# Altium project TP3_Microcontrolador.PrjPcb (part 1 of 2)
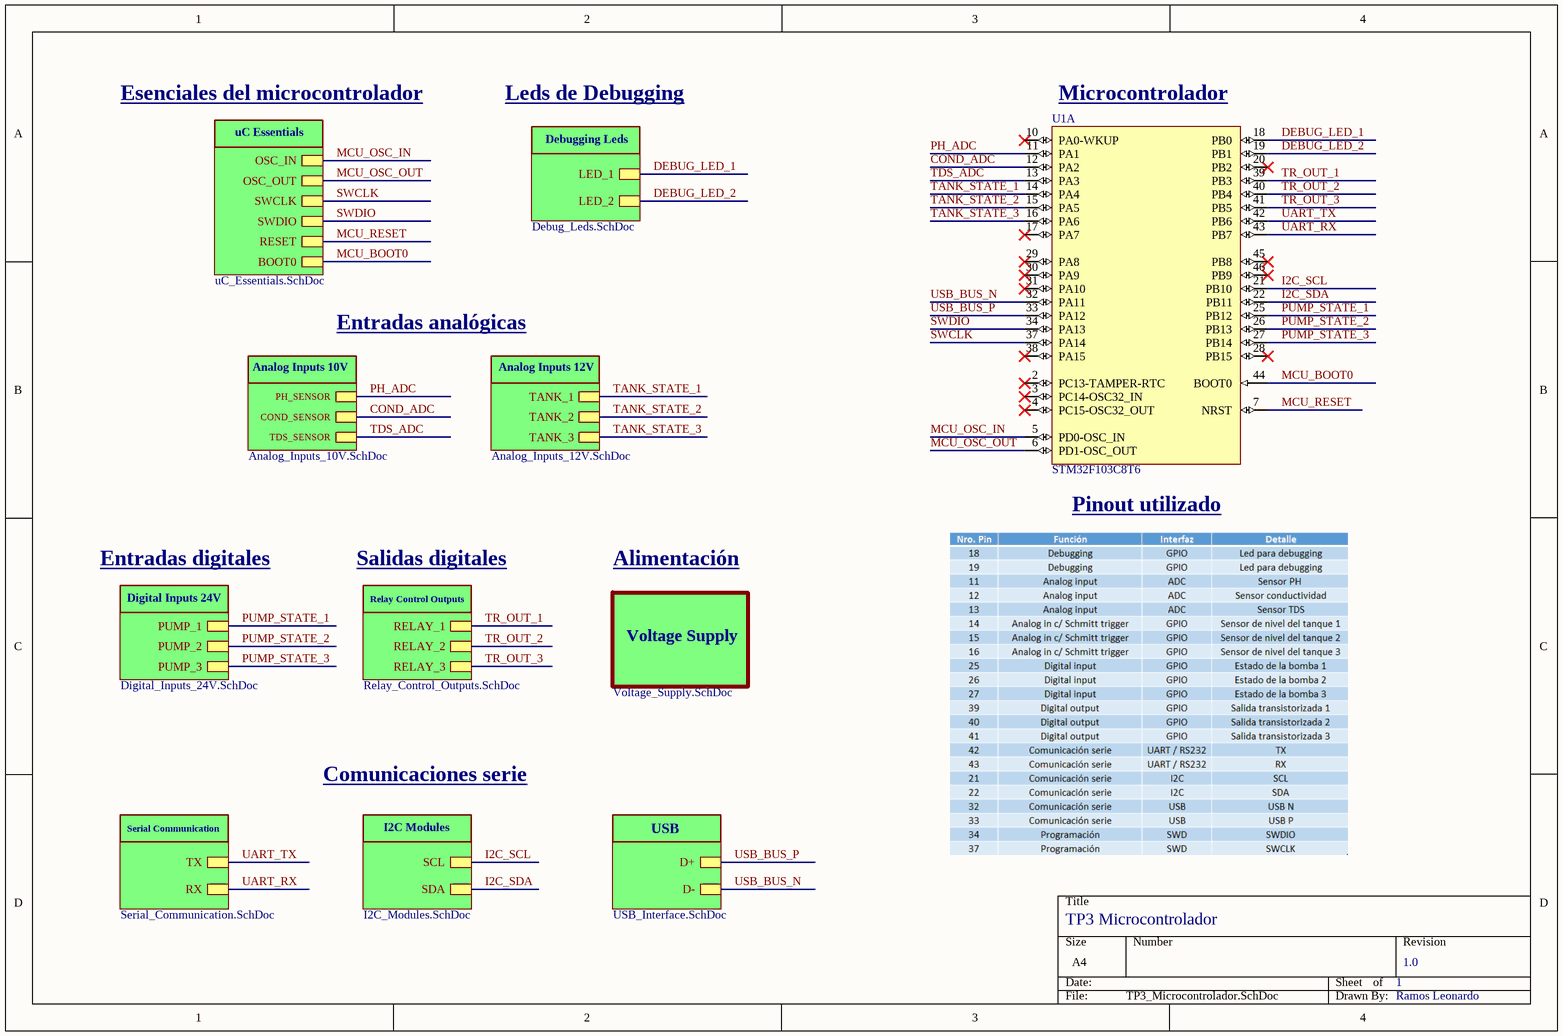
[diagram p0: TP3_Microcontrolador.SchDoc]
13 sheets, 109 parts. Net scope: hierarchical (ports join the sheet entries above them; power ports are global).
Board file: TP3_Microcontrolador.PcbDoc
Sheets:
  TP3_Microcontrolador.SchDoc
    Voltage_Supply = Voltage_Supply.SchDoc
      Buck_Converter = Buck_Converter.SchDoc
      LDO_1 = LDO_regulator.SchDoc
    Analog_Inputs_10V = Analog_Inputs_10V.SchDoc
    Analog_Inputs_12V = Analog_Inputs_12V.SchDoc
    Digital_Inputs_24V = Digital_Inputs_24V.SchDoc
    Relay_Control_Outputs = Relay_Control_Outputs.SchDoc
    Comunicacion_Serie = Serial_Communication.SchDoc
    Debug_Leds = Debug_Leds.SchDoc
    I2C_Modules = I2C_Modules.SchDoc
    uC_Essentials = uC_Essentials.SchDoc
    Interfaz_USB = USB_Interface.SchDoc

## Sheet TP3_Microcontrolador.SchDoc
size A4; SheetNumber: 1; SheetTotal: 13

### Parts
U1  STM32F103C8T6  [STM-LQFP48_L]  (part A of 2)

### Sub-sheets
Analog_Inputs_10V = Analog_Inputs_10V.SchDoc: PH_SENSOR, COND_SENSOR, TDS_SENSOR
Analog_Inputs_12V = Analog_Inputs_12V.SchDoc: TANK_1, TANK_2, TANK_3
Comunicacion_Serie = Serial_Communication.SchDoc: TX, RX
Debug_Leds = Debug_Leds.SchDoc: LED_1, LED_2
Digital_Inputs_24V = Digital_Inputs_24V.SchDoc: PUMP_1, PUMP_2, PUMP_3
I2C_Modules = I2C_Modules.SchDoc: SCL, SDA
Interfaz_USB = USB_Interface.SchDoc: D+, D-
Relay_Control_Outputs = Relay_Control_Outputs.SchDoc: RELAY_1, RELAY_2, RELAY_3
uC_Essentials = uC_Essentials.SchDoc: OSC_IN, OSC_OUT, SWCLK, SWDIO, RESET, BOOT0
Voltage_Supply = Voltage_Supply.SchDoc: no entries

### Nets
COND_ADC: U1.12(PA2) ; sheet Analog_Inputs_10V/COND_SENSOR
DEBUG_LED_1: U1.18(PB0) ; sheet Debug_Leds/LED_1
DEBUG_LED_2: U1.19(PB1) ; sheet Debug_Leds/LED_2
I2C_SCL: U1.21(PB10) ; sheet I2C_Modules/SCL
I2C_SDA: U1.22(PB11) ; sheet I2C_Modules/SDA
MCU_BOOT0: U1.44(BOOT0) ; sheet uC_Essentials/BOOT0
MCU_OSC_IN: U1.5(PD0-OSC_IN) ; sheet uC_Essentials/OSC_IN
MCU_OSC_OUT: U1.6(PD1-OSC_OUT) ; sheet uC_Essentials/OSC_OUT
MCU_RESET: U1.7(NRST) ; sheet uC_Essentials/RESET
PH_ADC: U1.11(PA1) ; sheet Analog_Inputs_10V/PH_SENSOR
PUMP_STATE_1: U1.25(PB12) ; sheet Digital_Inputs_24V/PUMP_1
PUMP_STATE_2: U1.26(PB13) ; sheet Digital_Inputs_24V/PUMP_2
PUMP_STATE_3: U1.27(PB14) ; sheet Digital_Inputs_24V/PUMP_3
SWCLK: U1.37(PA14) ; sheet uC_Essentials/SWCLK
SWDIO: U1.34(PA13) ; sheet uC_Essentials/SWDIO
TANK_STATE_1: U1.14(PA4) ; sheet Analog_Inputs_12V/TANK_1
TANK_STATE_2: U1.15(PA5) ; sheet Analog_Inputs_12V/TANK_2
TANK_STATE_3: U1.16(PA6) ; sheet Analog_Inputs_12V/TANK_3
TDS_ADC: U1.13(PA3) ; sheet Analog_Inputs_10V/TDS_SENSOR
TR_OUT_1: U1.39(PB3) ; sheet Relay_Control_Outputs/RELAY_1
TR_OUT_2: U1.40(PB4) ; sheet Relay_Control_Outputs/RELAY_2
TR_OUT_3: U1.41(PB5) ; sheet Relay_Control_Outputs/RELAY_3
UART_RX: U1.43(PB7) ; sheet Comunicacion_Serie/RX
UART_TX: U1.42(PB6) ; sheet Comunicacion_Serie/TX
USB_BUS_N: U1.32(PA11) ; sheet Interfaz_USB/D-
USB_BUS_P: U1.33(PA12) ; sheet Interfaz_USB/D+

Not connected (* = marked no-connect by the designer): U1 2(PC13-TAMPER-RTC)* 3(PC14-OSC32_IN)* 4(PC15-OSC32_OUT)* 10(PA0-WKUP)* 17(PA7)* 20(PB2)* 28(PB15)* 29(PA8)* 30(PA9)* 31(PA10)* 38(PA15)* 45(PB8)* 46(PB9)*

### Notes on the sheet
- Esenciales del microcontrolador
- Leds de Debugging
- (near U1) Microcontrolador
- uC Essentials
- Debugging Leds
- Analog Inputs 10V
- Entradas analógicas
- Analog Inputs 12V
- (near U1) Pinout utilizado
- Entradas digitales
- Salidas digitales
- Alimentación
- Digital Inputs 24V
- Relay Control Outputs
- Voltage Supply
- Comunicaciones serie
- Serial Communication
- I2C Modules
- USB
- TP3 Microcontrolador
- 1
- 1.0
- Ramos Leonardo

### Library data of the parts
U1 = CMP-0237-00215-3: ARM Cortex-M3 32-bit MCU, 64 KB Flash, 20 KB Internal RAM, 37 I/Os, 48-pin LQFP, -40 to 85 degC, Tray; Supply Voltage(Vcc) min (V): 2; Internal RAM Size (kB): 20; FLASH Size (Prog) (kB): 64; A/D Converter: 2x12-bit (10 Channel); I/Os (High Current): 37; Operating Frequency(F) (Processor speed) (MHz): 72; Core: ARM Cortex-M3; ComponentLink3Description: Package Specification; Mounting Technology: Surface Mount; PartNumber: STM32F103C8T6; PackageReference: LQFP48; Packing: Tray; ComponentLink3URL: http://www.st.com/st-web-ui/static/active/en/resource/technical/document/datasheet/DM00058181.pdf; DatasheetVersion: Rev. 16; ComponentLink1URL: http://www.st.com/web/en/home.html; PackageVersion: Rev. 6, 06/2013; ComponentLink2URL: http://www.st.com/st-web-ui/static/active/en/resource/technical/document/datasheet/CD00161566.pdf; ComponentLink1Description: Manufacturer URL; ComponentLink2Description: Datasheet; PackageDescription: 48-Pin Low Profile Quad Flat Package, 7 x 7 mm Body, 0.5 mm Pitch

## Sheet Voltage_Supply.SchDoc
size A4; SheetNumber: 2; SheetTotal: 13
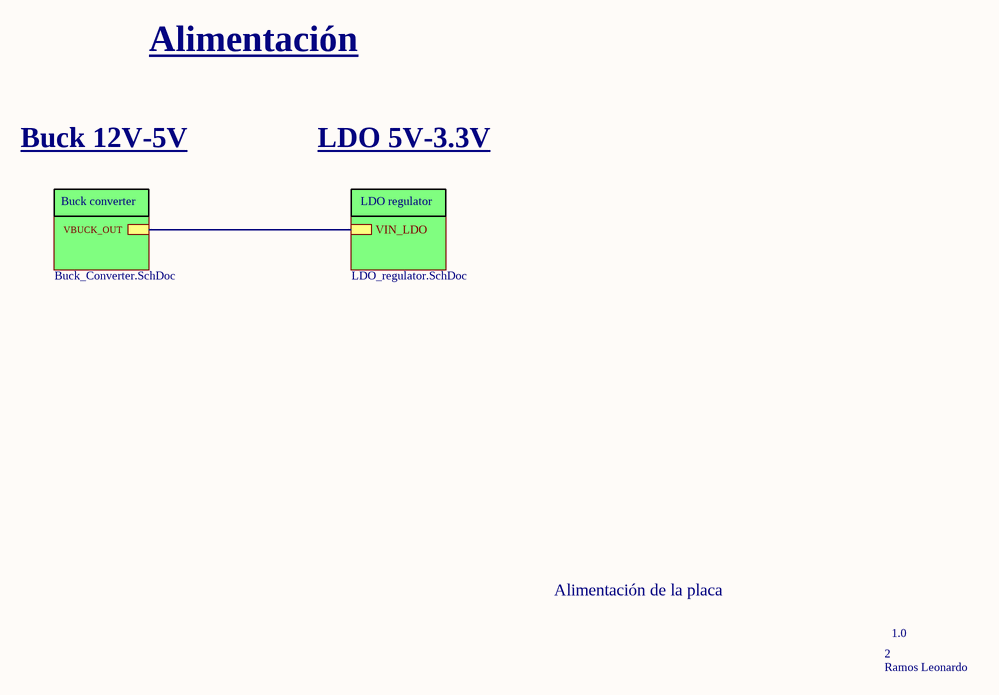
[diagram p1: Voltage_Supply.SchDoc]

### Sub-sheets
Buck_Converter = Buck_Converter.SchDoc: VBUCK_OUT
LDO_1 = LDO_regulator.SchDoc: VIN_LDO

### Nets
5V: sheet Buck_Converter/VBUCK_OUT, sheet LDO_1/VIN_LDO

### Notes on the sheet
- Alimentación
- Buck 12V-5V
- LDO 5V-3.3V
- Buck converter
- LDO regulator
- Alimentación de la placa
- 2
- 1.0
- Ramos Leonardo

## Sheet Buck_Converter.SchDoc
size A4; SheetNumber: 3; SheetTotal: 13
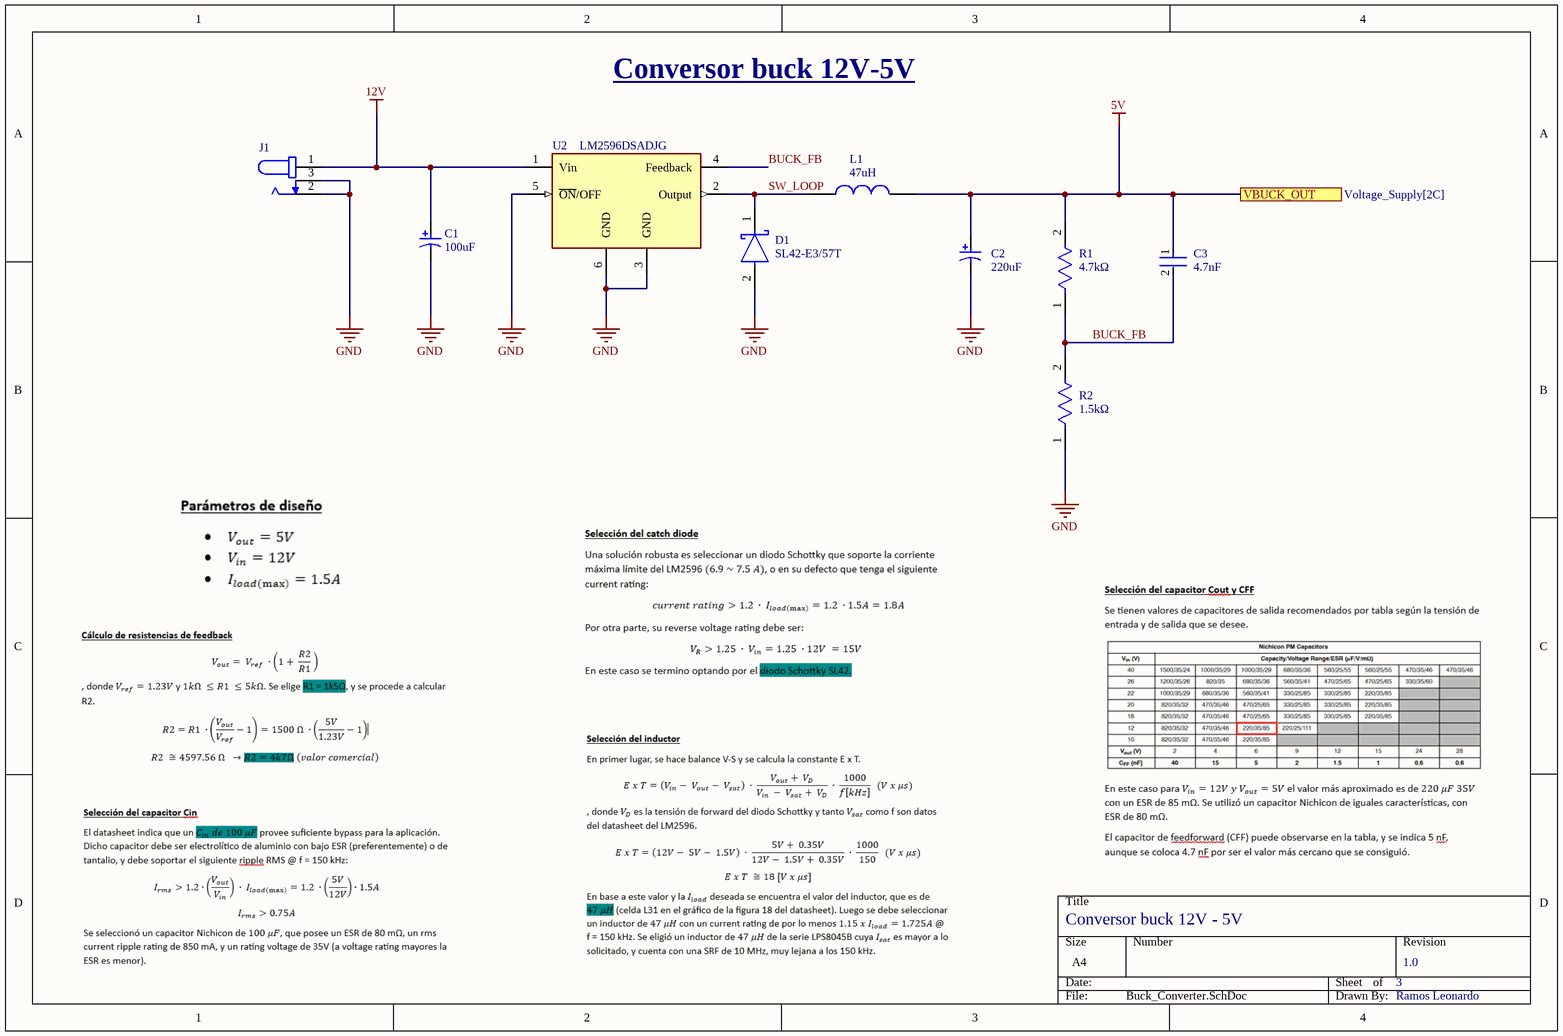
[diagram p2: Buck_Converter.SchDoc]

### Parts
C1  Capacitance: 100uF  [NIC-UCL1V101MNL1GS_L]  (hidden comment: UCL1V101MNL1GS)
C2  Capacitance: 220uF  [NIC-UCL1V101MNL1GS_L]  (hidden comment: UCL1V101MNL1GS)
C3  Capacitance: 4.7nF  [FP-GRM21B-0_1-IPC_B]  (hidden comment: GRM21B7U1A104JA01L)
D1  SL42-E3/57T  [FP-95402-MFG]
J1  DCJ200-10-A-XX-K_REVA  [GCT_DCJ200-10-A-XX-K_REVA]  (value not drawn)
L1  value 47uH  [LPS8045B_Series_Power_inductor]
R1  Resistance: 4.7kΩ  [FP-CRCW0805-e3-IPC_B]  (hidden comment: CRCW08054K70JNEA)
R2  Resistance: 1.5kΩ  [FP-CRCW0805-e3-IPC_B]  (hidden comment: CRCW08054K70JNEA)
U2  LM2596DSADJG  [FP-936A-02-MFG]

### Ports
VBUCK_OUT (see Voltage_Supply[2C])

### Nets
5V: C2.1 C3.1 L1.2 R1.2 ; port VBUCK_OUT
12V: C1.1 J1.1 U2.1(Vin)
GND: C1.2 C2.2 D1.2(A) J1.2 J1.3 R2.1 U2.3(GND) U2.5(~{ON}/OFF) U2.6(GND)
BUCK_FB: C3.2 R1.1 R2.2 U2.4(Feedback)
SW_LOOP: D1.1(C) L1.1 U2.2(Output)

### Notes on the sheet
- Conversor buck 12V-5V
- Conversor buck 12V - 5V
- 3
- 1.0
- Ramos Leonardo

### Library data of the parts
C1 = CMP-2000-07344-1: Aluminum Electrolytic Capacitor, 100 uF, 35 V, 20%, -55 to 105 degC, 2-Pin SMD, RoHS, Tape and Reel; Manufacturer: Nichicon; Dissipation Factor DF: 0.12; Case Diameter: 8mm; Ripple Current: 850mA; Type: AluminumElectrolyticCapacitors,ChipType,LowImpedance; Case Height: 8.3mm; Leakage Current: 3uA; Voltage Rating DC: 35V; Load Life: 2000h; Case Length: 10mm; Series: CL; Minimum Operating Temperature: -55C; Datasheet URL: http://datasheet.octopart.com/UCL1V101MNL1GS-Nichicon-datasheet-41194108.pdf; Manufacturer URL: http://www.nichicon.co.jp/english/; Maximum Operating Temperature: +105C; Package Reference: UCL1V101MNL1GS; Operating Temperature Range: -55Cto+105C; Brand: Nichicon; Package Description: 2-Pin Surface Mount Device, Body 8.3 x 8.3 mm, Height 10.8 mm; RoHS: Details; Voltage Rating: 35V; Dimensions: 8mmDia.x10mmLx8.3mmH; Termination Style: SMD/SMT; Datasheet Version: 01/2015; Packaging: Reel; Mounting Technology: SurfaceMount; Product Category: AluminumElectrolyticCapacitors-SMD; Factory Pack Quantity: 500; Product: LowImpedanceElectrolyticCapacitors; Tolerance: 20%
C2 = CMP-2000-07344-1: Aluminum Electrolytic Capacitor, 220 uF, 35 V, 20%, -55 to 105 degC, 2-Pin SMD, RoHS, Tape and Reel (80 mOhm); Manufacturer: Nichicon; Dissipation Factor DF: 0.12; Case Diameter: 8mm; Ripple Current: 850mA; Type: AluminumElectrolyticCapacitors,ChipType,LowImpedance; Case Height: 8.3mm; Leakage Current: 3uA; Voltage Rating DC: 35V; Load Life: 2000h; Case Length: 10mm; Series: CL; Minimum Operating Temperature: -55C; Datasheet URL: http://datasheet.octopart.com/UCL1V101MNL1GS-Nichicon-datasheet-41194108.pdf; Manufacturer URL: http://www.nichicon.co.jp/english/; Maximum Operating Temperature: +105C; Package Reference: UCL1V101MNL1GS; Operating Temperature Range: -55Cto+105C; Brand: Nichicon; Package Description: 2-Pin Surface Mount Device, Body 8.3 x 8.3 mm, Height 10.8 mm; RoHS: Details; Voltage Rating: 35V; Dimensions: 8mmDia.x10mmLx8.3mmH; Termination Style: SMD/SMT; Datasheet Version: 01/2015; Packaging: Reel; Mounting Technology: SurfaceMount; Product Category: AluminumElectrolyticCapacitors-SMD; Factory Pack Quantity: 500; Product: LowImpedanceElectrolyticCapacitors; Tolerance: 20%
C3 = CMP-06035-037063-1: Chip Multilayer Ceramic Capacitors for General Purpose, 0805, 4.7nF, U2J, -750ppm/°C, 5%, 10V; Depth: 1.25mm; Voltage Rating (DC): 10V; Voltage Rating: 10V; Length: 2mm; Max Operating Temperature: 125°C; Thickness: 0.053inch; Dielectric: U2J; Termination: SMD/SMT; Package Quantity: 3000; Packaging: Tape and Reel; Case Code (Metric): 2012; Tolerance: 5%; Case Code (Imperial): 0805; Case/Package: 0805; Mount: Surface Mount; Width: 0.049inch; Height: 1.25mm; Radiation Hardening: No; Min Operating Temperature: -55°C
D1 = CMP-00030-39552820-1: SL42-E3/57T Rectifier Diode, Schottky, 1 Phase, 1 Element, 4A, 20V V(RRM), Silicon, DO-214AB; Max Junction Temperature (Tj): 125°C; Max Reverse Leakage Current: 500µA; Max Surge Current: 150A; Forward Voltage: 470mV; Element Configuration: Single; Polarity: Standard; Max Reverse Voltage (DC): 20V; Radiation Hardening: No; Packaging: Cut Tape; Mount: Surface Mount; Reverse Voltage: 20V; Peak Reverse Current: 500µA; Lead Free: Lead Free; Max Operating Temperature: 125°C; Max Forward Surge Current (Ifsm): 150A; Peak Non-Repetitive Surge Current: 150A; Height: 2.62mm; Min Operating Temperature: -55°C; RoHS: Compliant; Forward Current: 4A; REACH SVHC: Unknown; Schedule B: 8541100080, 8541100080; Current Rating: 4A; Voltage Rating (DC): 20V; Max Repetitive Reverse Voltage (Vrrm): 20V; Number of Pins: 2; Output Current: 4A; NexarPartId: 39552820; Case/Package: SMC; Average Rectified Current: 4A
J1 = DCJ200-10-A-XX-K_REVA: Power Barrel Connector Jack 2.05mm ID (0.081), 5.50mm OD (0.217) Through Hole, Right Angle; MF: Global Connector Technology; MP: DCJ200-10-A-K1-K; SnapEDA_Link: https://www.snapeda.com/parts/DCJ200-10-A-K1-K/Global+Connector+Technology/view-part/?ref=snap; Package: None; Value: *; Check_prices: https://www.snapeda.com/parts/DCJ200-10-A-K1-K/Global+Connector+Technology/view-part/?ref=eda
L1 = L: Inductor genérico; Manufacturer: *; Manufacturer part number: *; Tolerance: *; Package size: *; Voltage rating: *
R1 = CMP-2001-03967-2: RES Thick Film, 1.5kΩ, 5%, 0.125W, 200ppm/°C, 0805; Power Rating: 125mW; Voltage Rating: 150V; Radiation Hardening: No; Case Code (Imperial): 0805; Military Standard: Not; Contact Plating: Tin; Weight: 0.000194oz; Mount: Surface Mount; Termination: SMD/SMT; Packaging: Tape and Reel; Min Operating Temperature: -55°C; Width: 1.25mm; Tolerance: 5%; Height: 0.45mm; Depth: 1.25mm; Length: 2mm; Temperature Coefficient: 200ppm/°C; Case Code (Metric): 2012; Package Quantity: 5000; Max Operating Temperature: 155°C; Case/Package: 0805; Composition: Thick Film
R2 = CMP-2001-03967-2: RES Thick Film, 4.7kΩ, 5%, 0.125W, 200ppm/°C, 0805; Power Rating: 125mW; Voltage Rating: 150V; Radiation Hardening: No; Case Code (Imperial): 0805; Military Standard: Not; Contact Plating: Tin; Weight: 0.000194oz; Mount: Surface Mount; Termination: SMD/SMT; Packaging: Tape and Reel; Min Operating Temperature: -55°C; Width: 1.25mm; Tolerance: 5%; Height: 0.45mm; Depth: 1.25mm; Length: 2mm; Temperature Coefficient: 200ppm/°C; Case Code (Metric): 2012; Package Quantity: 5000; Max Operating Temperature: 155°C; Case/Package: 0805; Composition: Thick Film
U2 = CMP-07129-000001-1: IC REG MULT CONFG ADJ 3A D2PAK-5; Manufacturer: ON Semiconductor; Max Duty Cycle: 95%; Nominal Supply Current: 5mA; Standoff Height: 0mm; Min Supply Voltage: 4.5V; Output Voltage: 1.23-37V; Negative Voltage Available: true; Number Of Outputs: 1; Max Junction Temp: +125°C; Output Type: AdjustableProgrammable; Max Supply Voltage: 40V; Switching Topology: Boost,Buck,Buck-Boost; Switching Frequency: 150Hz; Output Current: 3A; Device Class L1: Integrated Circuits (ICs); Height: 4.826mm; Manufacturer Part Number: LM2596DSADJG; ComponentLink2URL: https://www.onsemi.com/pub/Collateral/LM2596-D.PDF; Device Class L3: Voltage Regulators - Switching; Octopart: https://octopart.com/lm2596dsadjg-on+semiconductor-12437034; Mouser Description: Voltage Regulators - Switching Regulators 3A BUCK SWCH 150KHZ; Automotive: No; RoHS: TRUE; Temperature Range High: +125°C; ComponentLink2Description: Datasheet; Device Class L2: Power Management ICs; Digikey Description: IC REG MULT CONFG ADJ 3A D2PAK-5; Temperature Range Low: -40°C; Footprint Url: https://www.onsemi.com/pub/Collateral/936A-02.PDF; Lead Free: Yes; Temperature: -40°C to +125°C; Package: 936A-02; Category: IC

## Sheet LDO_regulator.SchDoc
size A4; SheetNumber: 4; SheetTotal: 13
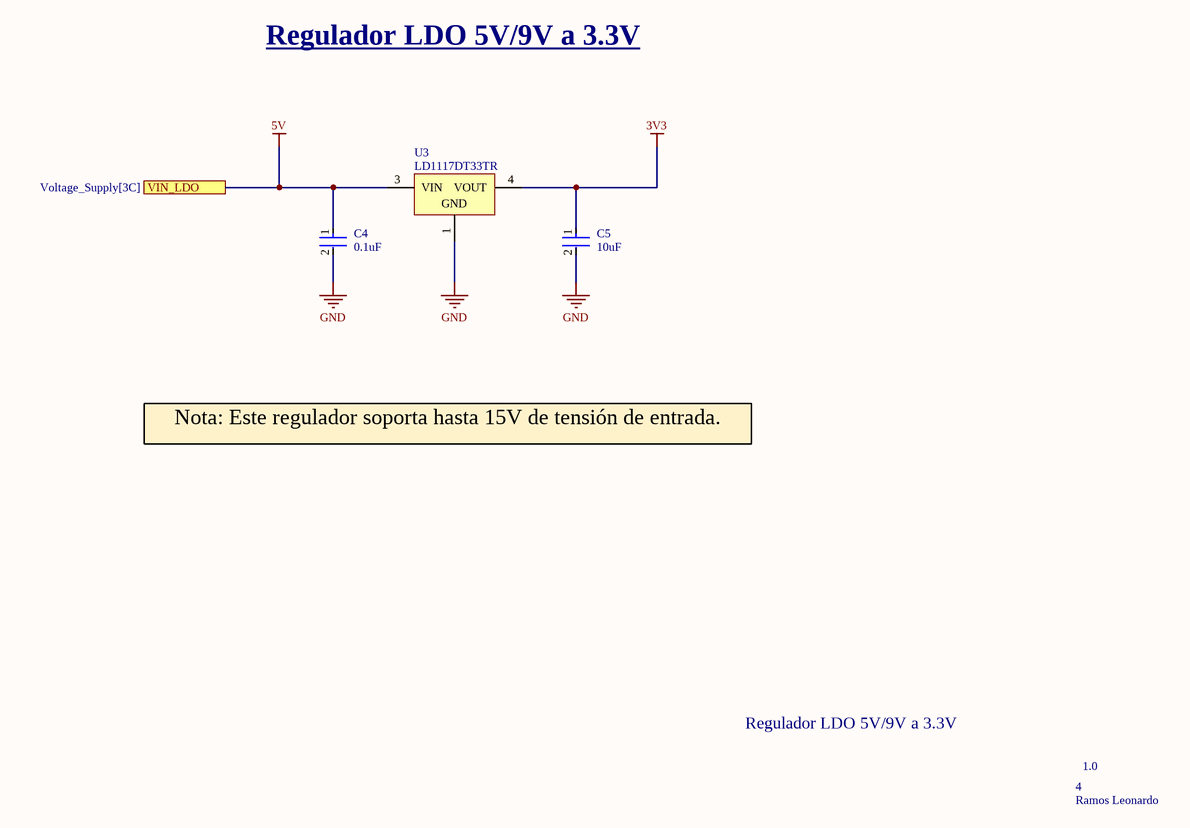
[diagram p3: LDO_regulator.SchDoc]

### Parts
C4  Capacitance: 0.1uF  [FP-GRM21B-0_1-IPC_B]  (hidden comment: 0.1u)
C5  Capacitance: 10uF  [FP-C0805C106J8RACAUTO-MFG]  (hidden comment: 10u)
U3  LD1117DT33TR  [TO-252_N]

### Ports
VIN_LDO (see Voltage_Supply[3C])

### Nets
3V3: C5.1 U3.4(VOUT)
5V: C4.1 U3.3(VIN) ; port VIN_LDO
GND: C4.2 C5.2 U3.1(GND)

### Notes on the sheet
- Regulador LDO 5V/9V a 3.3V
- Nota: Este regulador soporta hasta 15V de tensión de entrada.
- 4
- 1.0
- Ramos Leonardo

### Library data of the parts
C4 = CMP-06035-037063-1: Chip Multilayer Ceramic Capacitors for General Purpose, 0805, 0.10uF, U2J, -750ppm/°C, 5%, 10V; Depth: 1.25mm; Voltage Rating (DC): 10V; Voltage Rating: 10V; Length: 2mm; Max Operating Temperature: 125°C; Thickness: 0.053inch; Dielectric: U2J; Termination: SMD/SMT; Package Quantity: 3000; Packaging: Tape and Reel; Case Code (Metric): 2012; Tolerance: 5%; Case Code (Imperial): 0805; Case/Package: 0805; Mount: Surface Mount; Width: 0.049inch; Height: 1.25mm; Radiation Hardening: No; Min Operating Temperature: -55°C
C5 = CMP-03020-034708-1: CAP CER 10UF 10V X7R 0805; Tolerance: 5%; Mount: Surface Mount; Voltage Rating: 10V; Max Operating Temperature: 125°C; Min Operating Temperature: -55°C; Case/Package: 0805; RoHS Compliant: Yes; Packaging: Tape and Reel; Case Code (Imperial): 0805; Case Code (Metric): 2012; Ratings: AEC-Q200
U3 = LD1117DT33TR: Fixed Low Drop Positive Voltage Regulator, 3.3V, 3-Pin DPAK, Tape and Reel; ComponentLink1Description: Manufacturer URL; PackageVersion: 2011; PackageReference: TO-252; ComponentLink2Description: Datasheet; ComponentLink1URL: http://www.st.com; DatasheetVersion: 1/11/2011; PackageDescription: 3-Pin Transistor Outline Package 2.28 mm Pitch, 9.7 mm Lead Span (DPAK); ComponentLink2URL: http://www.st.com/internet/com/TECHNICAL_RESOURCES/TECHNICAL_LITERATURE/DATASHEET/CD00000544.pdf

## Sheet Analog_Inputs_10V.SchDoc
size A4; SheetNumber: 6; SheetTotal: 13
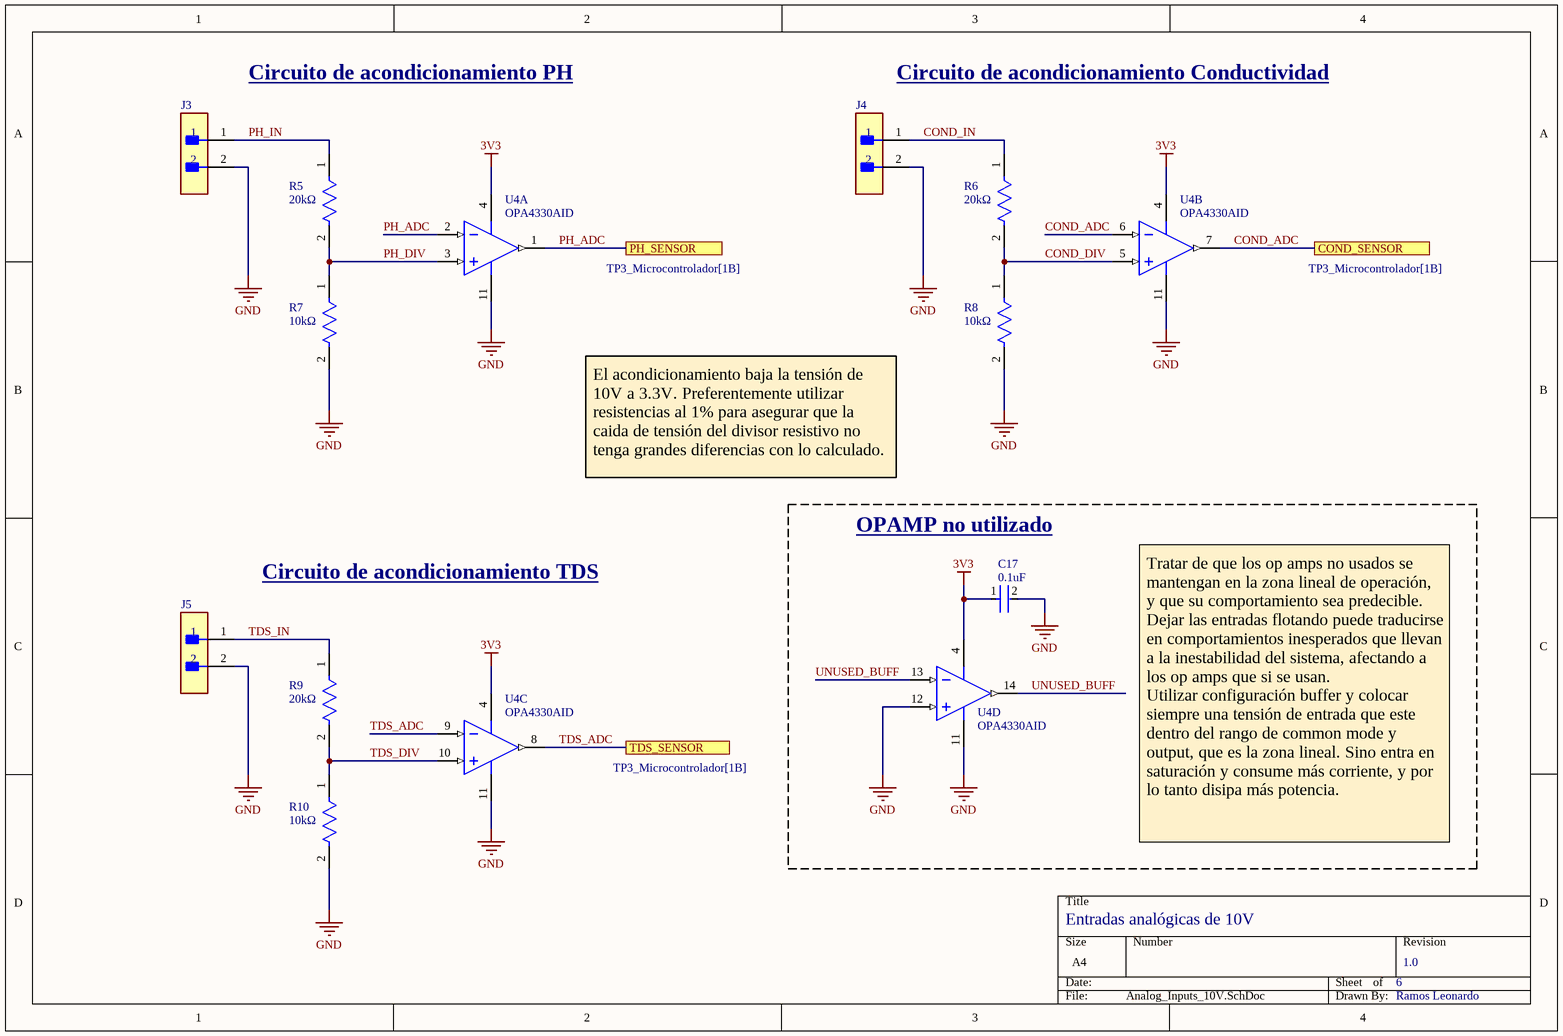
[diagram p4: Analog_Inputs_10V.SchDoc]

### Parts
C17  value 0.1uF  [FP-CC0805-0_85-MFG]  (hidden comment: CC0805KRX7R8BB104)
J3  26-60-4020  [FP-26-60-4020-MFG]  (value not drawn)
J4  26-60-4020  [FP-26-60-4020-MFG]  (value not drawn)
J5  26-60-4020  [FP-26-60-4020-MFG]  (value not drawn)
R5  Resistance: 20kΩ  [FP-CRCW0805-e3-IPC_B]  (hidden comment: CRCW08054K70JNEA)
R6  Resistance: 20kΩ  [FP-CRCW0805-e3-IPC_B]  (hidden comment: CRCW08054K70JNEA)
R7  Resistance: 10kΩ  [FP-CRCW0805-e3-IPC_B]  (hidden comment: CRCW08054K70JNEA)
R8  Resistance: 10kΩ  [FP-CRCW0805-e3-IPC_B]  (hidden comment: CRCW08054K70JNEA)
R9  Resistance: 20kΩ  [FP-CRCW0805-e3-IPC_B]  (hidden comment: CRCW08054K70JNEA)
R10  Resistance: 10kΩ  [FP-CRCW0805-e3-IPC_B]  (hidden comment: CRCW08054K70JNEA)
U4  OPA4330AID  [D0014A_N]  (parts A,B,C,D of 4)

### Blocks framed on the sheet
OPAMP no utilizado: C17 U4

### Ports
COND_SENSOR (see TP3_Microcontrolador[1B]), PH_SENSOR (see TP3_Microcontrolador[1B]), TDS_SENSOR (see TP3_Microcontrolador[1B])

### Nets
3V3: C17.1 U4.4(V+)
GND: C17.2 J3.2 J4.2 J5.2 R7.2 R8.2 R10.2 U4.11(V-) U4.12(IN_D+)
COND_ADC: U4.6(IN_B-) U4.7(OUT_B) ; port COND_SENSOR
COND_DIV: R6.2 R8.1 U4.5(IN_B+)
COND_IN: J4.1 R6.1
PH_ADC: U4.1(OUT_A) U4.2(IN_A-) ; port PH_SENSOR
PH_DIV: R5.2 R7.1 U4.3(IN_A+)
PH_IN: J3.1 R5.1
TDS_ADC: U4.8(OUT_C) U4.9(IN_C-) ; port TDS_SENSOR
TDS_DIV: R9.2 R10.1 U4.10(IN_C+)
TDS_IN: J5.1 R9.1
UNUSED_BUFF: U4.13(IN_D-) U4.14(OUT_D)

### Notes on the sheet
- Circuito de acondicionamiento PH
- Circuito de acondicionamiento Conductividad
- El acondicionamiento baja la tensión de 10V a 3.3V. Preferentemente utilizar resistencias al 1% para asegurar que la caida de tensión del divisor resistivo no tenga grandes diferencias con lo calculado.
- Circuito de acondicionamiento TDS
- Tratar de que los op amps no usados se mantengan en la zona lineal de operación, y que su comportamiento sea predecible. Dejar las entradas flotando puede traducirse en comportamientos inesperados que llevan a la inestabilidad del sistema, afectando a los op amps que si se usan.
  Utilizar configuración buffer y colocar siempre una tensión de entrada que este dentro del rango de common mode y output, que es la zona lineal. Sino entra en saturación y consume más corriente, y por lo tanto disipa más potencia.
- Entradas analógicas de 10V
- 6
- 1.0
- Ramos Leonardo

### Library data of the parts
C17 = CMP-1036-04410-2: CAP CER 0.1UF 25V X7R 0805; Manufacturer: Yageo; Tolerance: 0.1; Material: Ceramic; Capacitance: 100 nF; ComponentLink2URL: http://www.yageo.com/documents/recent/UPY-GPHC_Y5V_6.3V-to-50V_8.pdf; Category: Cap; Mouser Description: Multilayer Ceramic Capacitors MLCC - SMD/SMT 100nF 25V X7R 10%; Manufacturer Part Number: CC0805KRX7R8BB104; Device Class L1: Passive Components; Footprint Url: http://www.yageo.com/exep/pages/download/literatures/UPY-C_GEN_24.pdf; Height: 0.95mm; Digikey Description: CAP CER 0.1UF 25V X7R 0805; Lead Free: Yes; Temperature Range High: +85°C; Temperature: -30°C to +85°C; Ipc Land Pattern Name: CAPC200125X85; Automotive: No; Octopart: https://octopart.com/cc0805krx7r8bb104-yageo-39467766; Device Class L2: Capacitors; Temperature Characteristic: X7R; Voltage Rating: 25 V; ComponentLink2Description: Datasheet; Temperature Range Low: -30°C; Device Class L3: Ceramic Capacitors; RoHS: TRUE; Package: CC0805-0.85
J3-J5 = CMP-04776-000303-1: CONN HEADER VERT 2POS 3.96MM; Number of Contacts: 2; Contact Resistance: 6mR; Current Rating: 7A; Gender: Male; Voltage Rating: 250V; Number of Lines: 1; Approvals: UL; Glow Wire Compliant: Non-compliant; Depth: 10.01mm; Color: Natural; Mount: Through Hole; Flammability Rating: UL94 V-0; Max Operating Temperature: 75°C; Termination: Solder; Lead Free: Lead Free; Length: 7.77mm; Height: 14.73mm; Min Operating Temperature: 0°C; Contact Gender: Male; Housing Material: Polyester; Number of Rows: 1; Material: Polyester; Fastening Type: Friction; Contact Material: Brass; Radiation Hardening: No; Pitch: 3.96mm; Number of Circuits: 2; Contact Plating: Tin; Packaging: Bulk; Housing Color: Natural; Contact Mating Length: 0.45inch; Contact Type: Male Pin; Number of Positions: 2; Orientation: Straight; Package Quantity: 1400; Series: KK® 41791; Max Voltage Rating (AC): 250V; RoHS Compliant: Yes; Max Current Rating: 7A; Number of Poles: 2
R5-R10 = CMP-2001-03967-2: RES Thick Film, 10kΩ, 5%, 0.125W, 200ppm/°C, 0805; Power Rating: 125mW; Voltage Rating: 150V; Radiation Hardening: No; Case Code (Imperial): 0805; Military Standard: Not; Contact Plating: Tin; Weight: 0.000194oz; Mount: Surface Mount; Termination: SMD/SMT; Packaging: Tape and Reel; Min Operating Temperature: -55°C; Width: 1.25mm; Tolerance: 5%; Height: 0.45mm; Depth: 1.25mm; Length: 2mm; Temperature Coefficient: 200ppm/°C; Case Code (Metric): 2012; Package Quantity: 5000; Max Operating Temperature: 155°C; Case/Package: 0805; Composition: Thick Film
U4 = CMP-0272-00094-3: MicroPower, Precision, Zero Drift CMOS Operational Amplifier, 1.8 to 5.5 V, -40 to 125 degC, 14-pin SOIC (D14), Green (RoHS & no Sb/Br); Manufacturer: Texas Instruments; Iq per channel(Max)(mA): 0.035; Vio (25C)(Max)(mV): 0.05; Total Supply Voltage(Min)(+5V is 5, +/-5V is 10): 1.8; IIB(Max)(pA): 300; Number of Channels: 4; Total Supply Voltage(Max)(+5V is 5, +/-5V is 10): 5.5; Slew Rate(Typ)(V/us): 0.16; Offset Drift(Typ)(uV/C): 0.02; Vn at 1kHz(Typ)(nV/rtHz): 55; Sub Family: Low Offset Voltage Amplifier (<=500uV), Low Power Amp (<=500uA), Low Supply Voltage Amplifier (<=2.7V), Precision Amplifier; CMRR(Min)(dB): 100; ComponentLink2URL: http://www.ti.com/general/docs/lit/getliterature.tsp?genericPartNumber=OPA4330&fileType=pdf; PackageReference: D0014A; ComponentLink1Description: Manufacturer URL; ComponentLink1URL: http://www.ti.com/; PartNumber: OPA4330AID; ComponentLink2Description: Datasheet; DatasheetVersion: SBOS432E; Eco-Plan: Green (RoHS & no Sb/Br); ComponentLink3URL: http://www.ti.com/lit/ml/mpds177g/mpds177g.pdf; Mounting Technology: Surface Mount; ComponentLink3Description: Package Specification; PackageVersion: 4040047-5/M, 06/2011; PackageDescription: 14-Pin Plastic Small Outline, Body 8.65 x 3.9 mm, Pitch 1.27 mm; Code_JEDEC: MS-012

## Sheet Analog_Inputs_12V.SchDoc
size A4; SheetNumber: 7; SheetTotal: 13
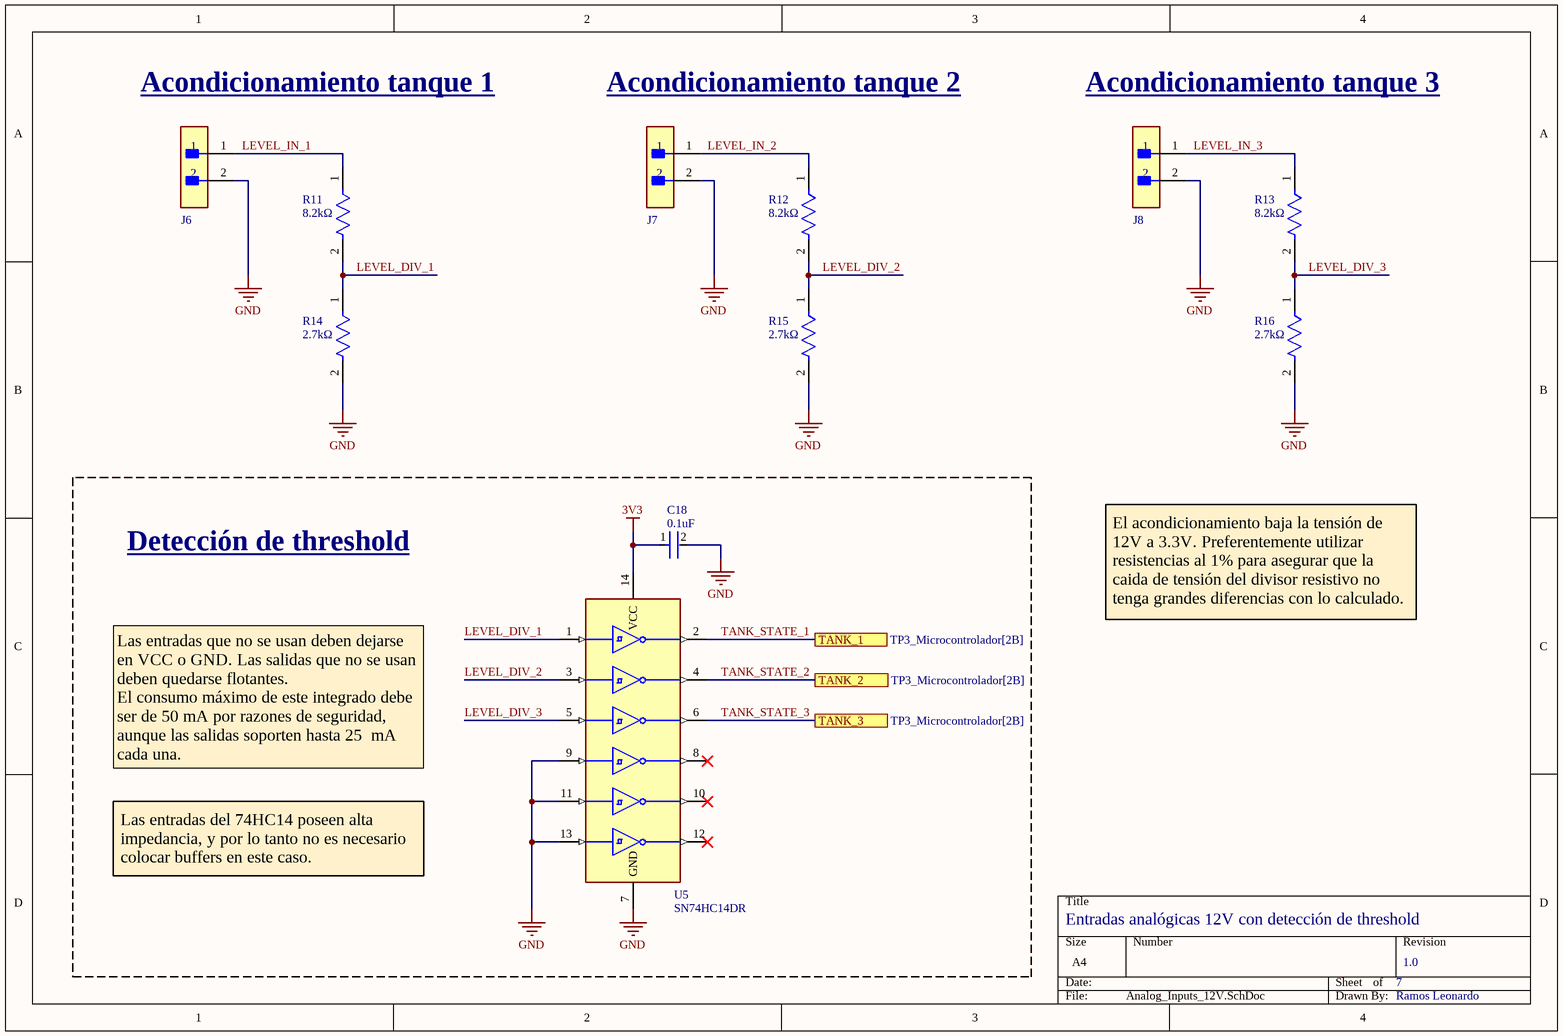
[diagram p5: Analog_Inputs_12V.SchDoc]

### Parts
C18  value 0.1uF  [FP-CC0805-0_85-MFG]  (hidden comment: CC0805KRX7R8BB104)
J6  26-60-4020  [FP-26-60-4020-MFG]  (value not drawn)
J7  26-60-4020  [FP-26-60-4020-MFG]  (value not drawn)
J8  26-60-4020  [FP-26-60-4020-MFG]  (value not drawn)
R11  Resistance: 8.2kΩ  [FP-CRCW0805-e3-IPC_B]  (hidden comment: CRCW08054K70JNEA)
R12  Resistance: 8.2kΩ  [FP-CRCW0805-e3-IPC_B]  (hidden comment: CRCW08054K70JNEA)
R13  Resistance: 8.2kΩ  [FP-CRCW0805-e3-IPC_B]  (hidden comment: CRCW08054K70JNEA)
R14  Resistance: 2.7kΩ  [FP-CRCW0805-e3-IPC_B]  (hidden comment: CRCW08054K70JNEA)
R15  Resistance: 2.7kΩ  [FP-CRCW0805-e3-IPC_B]  (hidden comment: CRCW08054K70JNEA)
R16  Resistance: 2.7kΩ  [FP-CRCW0805-e3-IPC_B]  (hidden comment: CRCW08054K70JNEA)
U5  SN74HC14DR  [FP-D0014A-IPC_C]

### Blocks framed on the sheet
Detección de threshold: C18 U5

### Ports
TANK_1 (see TP3_Microcontrolador[2B]), TANK_2 (see TP3_Microcontrolador[2B]), TANK_3 (see TP3_Microcontrolador[2B])

### Nets
3V3: C18.1 U5.14(VCC)
GND: C18.2 J6.2 J7.2 J8.2 R14.2 R15.2 R16.2 U5.7(GND) U5.9(4A) U5.11(5A) U5.13(6A)
LEVEL_DIV_1: R11.2 R14.1 U5.1(1A)
LEVEL_DIV_2: R12.2 R15.1 U5.3(2A)
LEVEL_DIV_3: R13.2 R16.1 U5.5(3A)
LEVEL_IN_1: J6.1 R11.1
LEVEL_IN_2: J7.1 R12.1
LEVEL_IN_3: J8.1 R13.1
TANK_STATE_1: U5.2(1Y) ; port TANK_1
TANK_STATE_2: U5.4(2Y) ; port TANK_2
TANK_STATE_3: U5.6(3Y) ; port TANK_3

Not connected (* = marked no-connect by the designer): U5 8(4Y)* 10(5Y)* 12(6Y)*

### Notes on the sheet
- Acondicionamiento tanque 1
- Acondicionamiento tanque 2
- Acondicionamiento tanque 3
- El acondicionamiento baja la tensión de 12V a 3.3V. Preferentemente utilizar resistencias al 1% para asegurar que la caida de tensión del divisor resistivo no tenga grandes diferencias con lo calculado.
- Las entradas que no se usan deben dejarse en VCC o GND. Las salidas que no se usan deben quedarse flotantes.
  El consumo máximo de este integrado debe ser de 50 mA por razones de seguridad, aunque las salidas soporten hasta 25  mA cada una.
- Las entradas del 74HC14 poseen alta impedancia, y por lo tanto no es necesario colocar buffers en este caso.
- Entradas analógicas 12V con detección de threshold
- 7
- 1.0
- Ramos Leonardo

### Library data of the parts
C18 = CMP-1036-04410-2: as C17 on sheet Analog_Inputs_10V; ComponentLink2URL: http://www.yageo.com/documents/recent/UPY-GPHC_Y5V_6.3V-to-50V_8.pdf; Category: Cap; Mouser Description: Multilayer Ceramic Capacitors MLCC - SMD/SMT 100nF 25V X7R 10%; Manufacturer Part Number: CC0805KRX7R8BB104; Device Class L1: Passive Components; Footprint Url: http://www.yageo.com/exep/pages/download/literatures/UPY-C_GEN_24.pdf; Height: 0.95mm; Digikey Description: CAP CER 0.1UF 25V X7R 0805; Lead Free: Yes; Temperature Range High: +85°C; Temperature: -30°C to +85°C; Ipc Land Pattern Name: CAPC200125X85; Automotive: No; Octopart: https://octopart.com/cc0805krx7r8bb104-yageo-39467766; Device Class L2: Capacitors; Temperature Characteristic: X7R; Voltage Rating: 25 V; ComponentLink2Description: Datasheet; Temperature Range Low: -30°C; Device Class L3: Ceramic Capacitors; RoHS: TRUE; Package: CC0805-0.85
J6-J8 = CMP-04776-000303-1: as J3 on sheet Analog_Inputs_10V; Depth: 10.01mm; Color: Natural; Mount: Through Hole; Flammability Rating: UL94 V-0; Max Operating Temperature: 75°C; Termination: Solder; Lead Free: Lead Free; Length: 7.77mm; Height: 14.73mm; Min Operating Temperature: 0°C; Contact Gender: Male; Housing Material: Polyester; Number of Rows: 1; Material: Polyester; Fastening Type: Friction; Contact Material: Brass; Radiation Hardening: No; Pitch: 3.96mm; Number of Circuits: 2; Contact Plating: Tin; Packaging: Bulk; Housing Color: Natural; Contact Mating Length: 0.45inch; Contact Type: Male Pin; Number of Positions: 2; Orientation: Straight; Package Quantity: 1400; Series: KK® 41791; Max Voltage Rating (AC): 250V; RoHS Compliant: Yes; Max Current Rating: 7A; Number of Poles: 2
R11-R13 R15 R16 = CMP-2001-03967-2: RES Thick Film, 5%, 0.125W, 200ppm/°C, 0805; Power Rating: 125mW; Voltage Rating: 150V; Radiation Hardening: No; Case Code (Imperial): 0805; Military Standard: Not; Contact Plating: Tin; Weight: 0.000194oz; Mount: Surface Mount; Termination: SMD/SMT; Packaging: Tape and Reel; Min Operating Temperature: -55°C; Width: 1.25mm; Tolerance: 5%; Height: 0.45mm; Depth: 1.25mm; Length: 2mm; Temperature Coefficient: 200ppm/°C; Case Code (Metric): 2012; Package Quantity: 5000; Max Operating Temperature: 155°C; Case/Package: 0805; Composition: Thick Film
R14 = CMP-2001-03967-2: RES Thick Film,  5%, 0.125W, 200ppm/°C, 0805; Power Rating: 125mW; Voltage Rating: 150V; Radiation Hardening: No; Case Code (Imperial): 0805; Military Standard: Not; Contact Plating: Tin; Weight: 0.000194oz; Mount: Surface Mount; Termination: SMD/SMT; Packaging: Tape and Reel; Min Operating Temperature: -55°C; Width: 1.25mm; Tolerance: 5%; Height: 0.45mm; Depth: 1.25mm; Length: 2mm; Temperature Coefficient: 200ppm/°C; Case Code (Metric): 2012; Package Quantity: 5000; Max Operating Temperature: 155°C; Case/Package: 0805; Composition: Thick Film
U5 = CMP-1615-00273-4: IC INVERTER SCHMITT 6CH 14SOIC; Logic Function: Buffer; Max Supply Voltage: 6V; Propagation Delay: 155ns; Number of Elements: 6; Quiescent Current: 2uA; Number of Inputs: 1; High Level Output Current: -5.2mA; Turn-On Delay Time: 31ns; Min Supply Voltage: 2V; Low Level Output Current: 5.2mA; Operating Supply Voltage: 5V; Input Type: SCHMITT TRIGGER; Schmitt Trigger Input: Yes; REACH SVHC: No SVHC; Series: 74HC; Width: 3.91mm; Number of Pins: 14; Max Operating Temperature: 85°C; Length: 8.65mm; Radiation Hardening: No; Technology: CMOS; Number of Bits: 6; Case/Package: SOIC; Package Quantity: 2500; Number of Gates: 6; Lead Free: Lead Free; Number of Circuits: 6; Output Current: 5.2mA; Height: 1.58mm; Min Operating Temperature: -40°C; Contact Plating: Gold; RoHS Compliant: Yes; Weight: 0.004318oz; Mount: Surface Mount; Packaging: Tape and Reel

## Sheet Digital_Inputs_24V.SchDoc
size A4; SheetNumber: 8; SheetTotal: 13
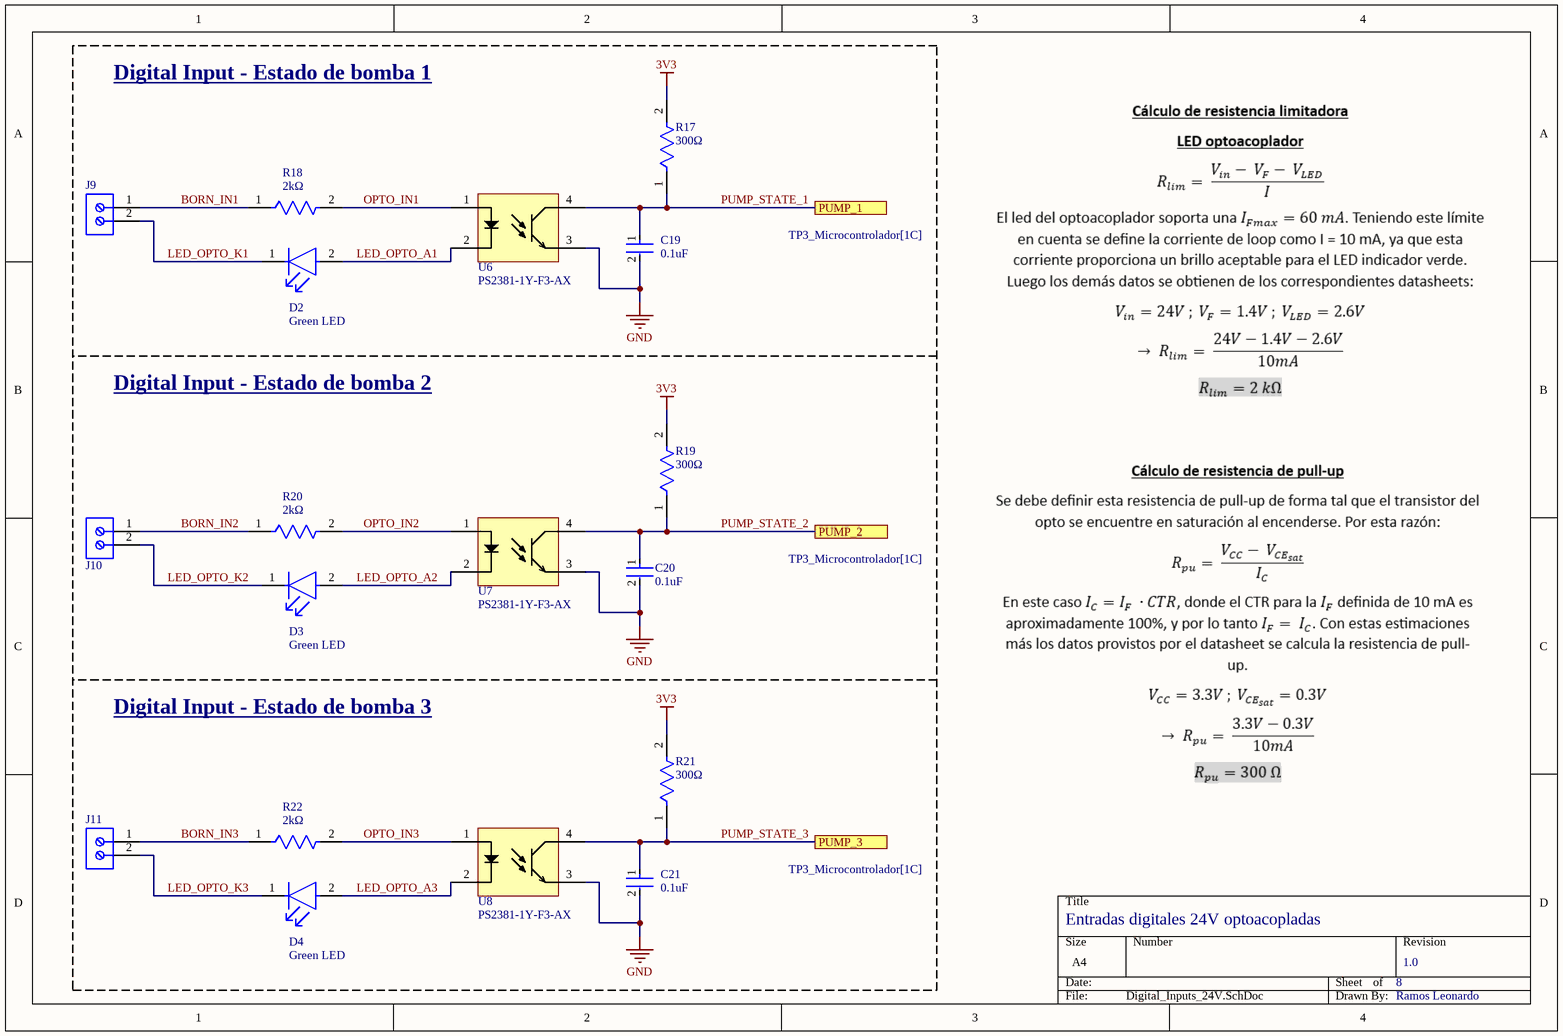
[diagram p6: Digital_Inputs_24V.SchDoc]

### Parts
C19  value 0.1uF  [FP-CC0805-0_85-MFG]  (hidden comment: CC0805KRX7R8BB104)
C20  value 0.1uF  [FP-CC0805-0_85-MFG]  (hidden comment: CC0805KRX7R8BB104)
C21  value 0.1uF  [FP-CC0805-0_85-MFG]  (hidden comment: CC0805KRX7R8BB104)
D2  Green LED  [FP-LTST-C170GKT-MFG]
D3  Green LED  [FP-LTST-C170GKT-MFG]
D4  Green LED  [FP-LTST-C170GKT-MFG]
J9  691137710002  [691137710002]  (value not drawn)
J10  691137710002  [691137710002]  (value not drawn)
J11  691137710002  [691137710002]  (value not drawn)
R17  Resistance: 300Ω  [FP-CRCW0805-e3-IPC_B]  (hidden comment: CRCW08054K70JNEA)
R18  Resistance: 2kΩ  [FP-CRCW0805-e3-IPC_B]  (hidden comment: CRCW08054K70JNEA)
R19  Resistance: 300Ω  [FP-CRCW0805-e3-IPC_B]  (hidden comment: CRCW08054K70JNEA)
R20  Resistance: 2kΩ  [FP-CRCW0805-e3-IPC_B]  (hidden comment: CRCW08054K70JNEA)
R21  Resistance: 300Ω  [FP-CRCW0805-e3-IPC_B]  (hidden comment: CRCW08054K70JNEA)
R22  Resistance: 2kΩ  [FP-CRCW0805-e3-IPC_B]  (hidden comment: CRCW08054K70JNEA)
U6  PS2381-1Y-F3-AX  [LSOP254P1020X230-4N]
U7  PS2381-1Y-F3-AX  [LSOP254P1020X230-4N]
U8  PS2381-1Y-F3-AX  [LSOP254P1020X230-4N]

### Ports
PUMP_1 (see TP3_Microcontrolador[1C]), PUMP_2 (see TP3_Microcontrolador[1C]), PUMP_3 (see TP3_Microcontrolador[1C])

### Nets
3V3: R17.2 R19.2 R21.2
GND: C19.2 C20.2 C21.2 U6.3(Emitter) U7.3(Emitter) U8.3(Emitter)
BORN_IN1: J9.1 R18.1
BORN_IN2: J10.1 R20.1
BORN_IN3: J11.1 R22.1
LED_OPTO_A1: D2.2(A) U6.2(Cathode)
LED_OPTO_A2: D3.2(A) U7.2(Cathode)
LED_OPTO_A3: D4.2(A) U8.2(Cathode)
LED_OPTO_K1: D2.1(C) J9.2
LED_OPTO_K2: D3.1(C) J10.2
LED_OPTO_K3: D4.1(C) J11.2
OPTO_IN1: R18.2 U6.1(Anode)
OPTO_IN2: R20.2 U7.1(Anode)
OPTO_IN3: R22.2 U8.1(Anode)
PUMP_STATE_1: C19.1 R17.1 U6.4(Collector) ; port PUMP_1
PUMP_STATE_2: C20.1 R19.1 U7.4(Collector) ; port PUMP_2
PUMP_STATE_3: C21.1 R21.1 U8.4(Collector) ; port PUMP_3

### Notes on the sheet
- Digital Input - Estado de bomba 1
- Digital Input - Estado de bomba 2
- Digital Input - Estado de bomba 3
- Entradas digitales 24V optoacopladas
- 8
- 1.0
- Ramos Leonardo

### Library data of the parts
C19-C21 = CMP-1036-04410-2: as C17 on sheet Analog_Inputs_10V; ComponentLink2URL: http://www.yageo.com/documents/recent/UPY-GPHC_Y5V_6.3V-to-50V_8.pdf; Category: Cap; Mouser Description: Multilayer Ceramic Capacitors MLCC - SMD/SMT 100nF 25V X7R 10%; Manufacturer Part Number: CC0805KRX7R8BB104; Device Class L1: Passive Components; Footprint Url: http://www.yageo.com/exep/pages/download/literatures/UPY-C_GEN_24.pdf; Height: 0.95mm; Digikey Description: CAP CER 0.1UF 25V X7R 0805; Lead Free: Yes; Temperature Range High: +85°C; Temperature: -30°C to +85°C; Ipc Land Pattern Name: CAPC200125X85; Automotive: No; Octopart: https://octopart.com/cc0805krx7r8bb104-yageo-39467766; Device Class L2: Capacitors; Temperature Characteristic: X7R; Voltage Rating: 25 V; ComponentLink2Description: Datasheet; Temperature Range Low: -30°C; Device Class L3: Ceramic Capacitors; RoHS: TRUE; Package: CC0805-0.85
D2-D4 = CMP-1674-00002-6: LED GREEN CLEAR SMD LTST-C170GKT; Dominant Wavelength: 569nm; Lens Style: Diffused; Forward Voltage: 2.1V; Number of Elements: 1; Wavelength: 565nm; Luminous Intensity: 6mcd; Test Current: 10mA; Power Dissipation: 100mW; Reverse Voltage: 5V; Forward Current: 30mA; Viewing Angle: 130°; Lens Color: Colorless; Min Operating Temperature: -55°C; Number of Pins: 2; Max Operating Temperature: 85°C; Color: Green; Radiation Hardening: No; Illumination Color: Green; Case Code (Metric): 2012; Lens Transparency: Clear; Case/Package: 0805; Width: 1.25mm; Case Code (Imperial): 0805; Package Quantity: 1; Height: 1.1mm; Depth: 1.25mm; Length: 2mm; Power Rating: 100mW; Lead Free: Lead Free; Number of LEDs: 1; Packaging: Tape and Reel; Mount: Surface Mount; Voltage: 5V
J9-J11 = CMP-1502-03324-2: NexarPartId: 78871135; Voltage Rating: 300V; Number of Contacts: 2; Current Rating: 16A; Lead Pitch: 5mm; Height: 11.6mm; Packaging: Box; RoHS: Non-Compliant; Contact Material: Nickel, Tin; Max Operating Temperature: 120°C; Number of Pins: 2; Min Operating Temperature: -30°C; Number of Rows: 1
R17-R19 R21 = CMP-2001-03967-2: as R11 on sheet Analog_Inputs_12V; Radiation Hardening: No; Case Code (Imperial): 0805; Military Standard: Not; Contact Plating: Tin; Weight: 0.000194oz; Mount: Surface Mount; Termination: SMD/SMT; Packaging: Tape and Reel; Min Operating Temperature: -55°C; Width: 1.25mm; Tolerance: 5%; Height: 0.45mm; Depth: 1.25mm; Length: 2mm; Temperature Coefficient: 200ppm/°C; Case Code (Metric): 2012; Package Quantity: 5000; Max Operating Temperature: 155°C; Case/Package: 0805; Composition: Thick Film
R20 R22 = CMP-2001-03967-2: as R2 on sheet Buck_Converter; Radiation Hardening: No; Case Code (Imperial): 0805; Military Standard: Not; Contact Plating: Tin; Weight: 0.000194oz; Mount: Surface Mount; Termination: SMD/SMT; Packaging: Tape and Reel; Min Operating Temperature: -55°C; Width: 1.25mm; Tolerance: 5%; Height: 0.45mm; Depth: 1.25mm; Length: 2mm; Temperature Coefficient: 200ppm/°C; Case Code (Metric): 2012; Package Quantity: 5000; Max Operating Temperature: 155°C; Case/Package: 0805; Composition: Thick Film
U6-U8 = CMP-00572-25656563-1: PS2381-1Y-F3-AX Optocoupler, Transistor, 5Kv, Lsop-4 Rohs Compliant: Yes; Forward Current: 60mA; Reverse Breakdown Voltage: 6V; Collector Emitter Saturation Voltage: 300mV; Forward Voltage: 1.4V; Current Transfer Ratio: 400%; Number of Elements: 1; Collector Emitter Voltage (VCEO): 80V; Power Dissipation: 250mW; Max Operating Temperature: 115°C; Number of Pins: 4; Mount: Surface Mount; NexarPartId: 25656563; Case/Package: SOP; Min Operating Temperature: -40°C; RoHS: Compliant; Packaging: Tape and Reel

## Sheet Relay_Control_Outputs.SchDoc
size A4; SheetNumber: 9; SheetTotal: 13
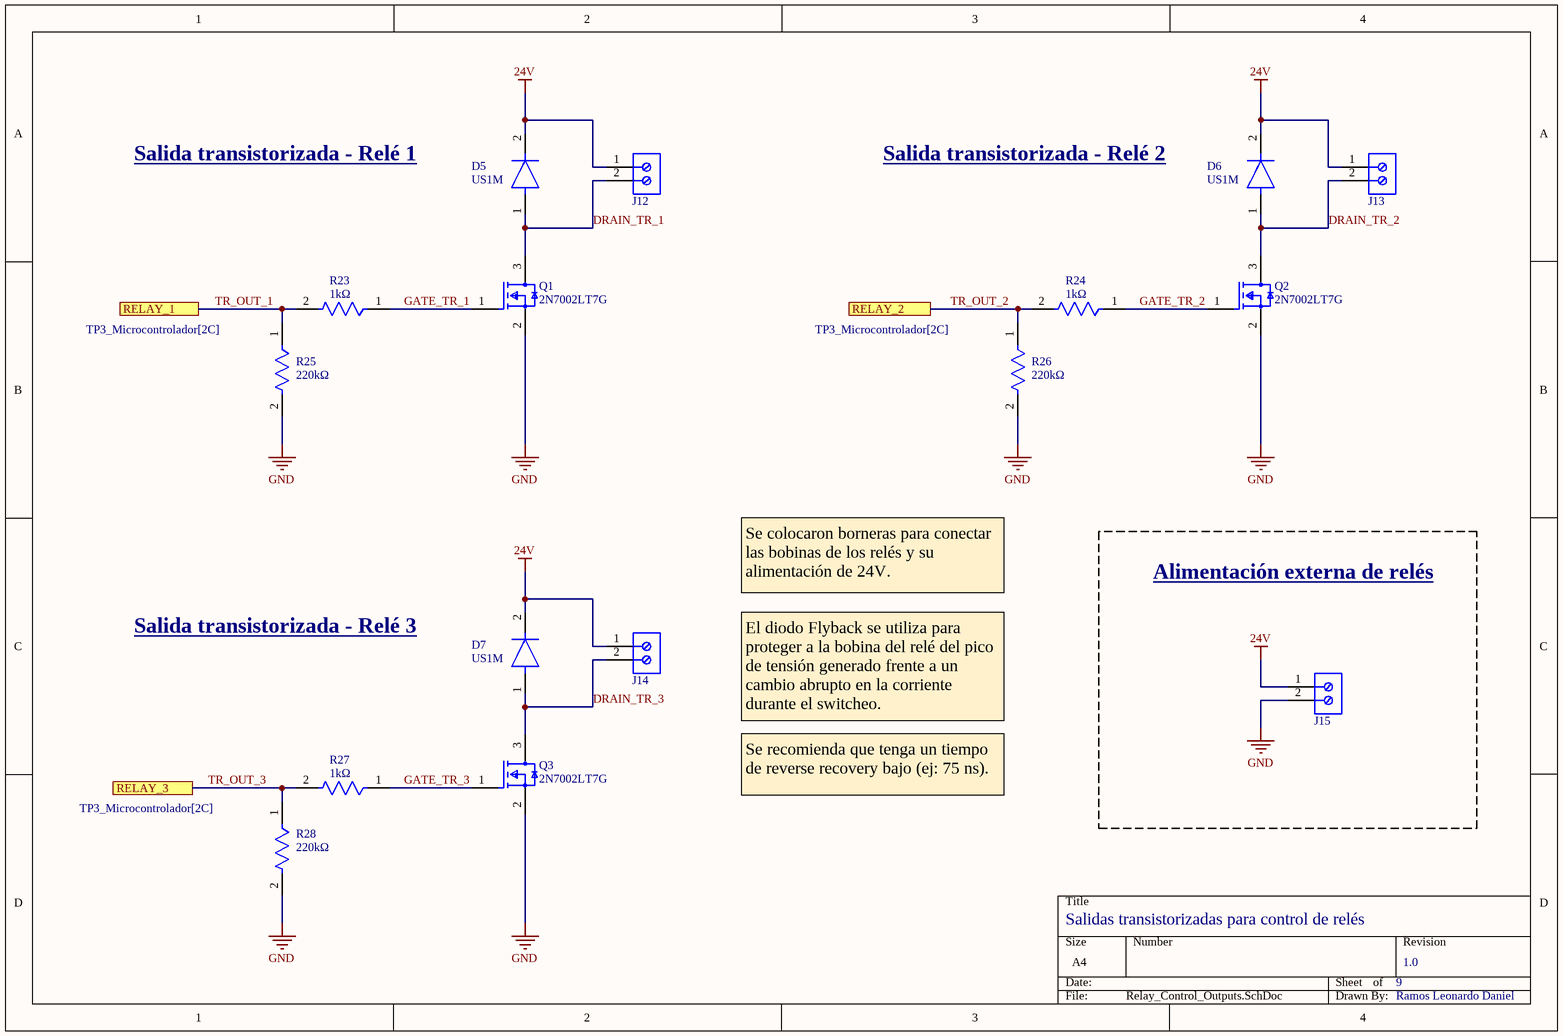
[diagram p7: Relay_Control_Outputs.SchDoc]

### Parts
D5  US1M  [SMA_DO-214AC]
D6  US1M  [SMA_DO-214AC]
D7  US1M  [SMA_DO-214AC]
J12  691137710002  [691137710002]  (value not drawn)
J13  691137710002  [691137710002]  (value not drawn)
J14  691137710002  [691137710002]  (value not drawn)
J15  691137710002  [691137710002]  (value not drawn)
Q1  2N7002LT7G  [FP-318-MFG]
Q2  2N7002LT7G  [FP-318-MFG]
Q3  2N7002LT7G  [FP-318-MFG]
R23  Resistance: 1kΩ  [FP-CRCW0805-e3-IPC_B]  (hidden comment: CRCW08054K70JNEA)
R24  Resistance: 1kΩ  [FP-CRCW0805-e3-IPC_B]  (hidden comment: CRCW08054K70JNEA)
R25  Resistance: 220kΩ  [FP-CRCW0805-e3-IPC_B]  (hidden comment: CRCW08054K70JNEA)
R26  Resistance: 220kΩ  [FP-CRCW0805-e3-IPC_B]  (hidden comment: CRCW08054K70JNEA)
R27  Resistance: 1kΩ  [FP-CRCW0805-e3-IPC_B]  (hidden comment: CRCW08054K70JNEA)
R28  Resistance: 220kΩ  [FP-CRCW0805-e3-IPC_B]  (hidden comment: CRCW08054K70JNEA)

### Blocks framed on the sheet
Alimentación externa de relés: J15

### Ports
RELAY_1 (see TP3_Microcontrolador[2C]), RELAY_2 (see TP3_Microcontrolador[2C]), RELAY_3 (see TP3_Microcontrolador[2C])

### Nets
24V: D5.2(K) D6.2(K) D7.2(K) J12.1 J13.1 J14.1 J15.1
GND: J15.2 Q1.2(Source) Q2.2(Source) Q3.2(Source) R25.2 R26.2 R28.2
DRAIN_TR_1: D5.1(A) J12.2 Q1.3(Drain)
DRAIN_TR_2: D6.1(A) J13.2 Q2.3(Drain)
DRAIN_TR_3: D7.1(A) J14.2 Q3.3(Drain)
GATE_TR_1: Q1.1(Gate) R23.1
GATE_TR_2: Q2.1(Gate) R24.1
GATE_TR_3: Q3.1(Gate) R27.1
TR_OUT_1: R23.2 R25.1 ; port RELAY_1
TR_OUT_2: R24.2 R26.1 ; port RELAY_2
TR_OUT_3: R27.2 R28.1 ; port RELAY_3

### Notes on the sheet
- (near D5) Salida transistorizada - Relé 1
- (near D6) Salida transistorizada - Relé 2
- (near D7) Salida transistorizada - Relé 3
- Se colocaron borneras para conectar las bobinas de los relés y su alimentación de 24V.
- El diodo Flyback se utiliza para proteger a la bobina del relé del pico de tensión generado frente a un cambio abrupto en la corriente durante el switcheo.
- Se recomienda que tenga un tiempo de reverse recovery bajo (ej: 75 ns).
- Salidas transistorizadas para control de relés
- 9
- 1.0
- Ramos Leonardo Daniel

### Library data of the parts
D5-D7 = Diode: Simbolo genérico de diodo.
J12-J15 = CMP-1502-03324-2: as J9 on sheet Digital_Inputs_24V; Lead Pitch: 5mm; Height: 11.6mm; Packaging: Box; RoHS: Non-Compliant; Contact Material: Nickel, Tin; Max Operating Temperature: 120°C; Number of Pins: 2; Min Operating Temperature: -30°C; Number of Rows: 1
Q1-Q3 = CMP-00278-97862277-1: 2N7002LT7G SOT23, N-Channel MOSFET - 60V 115MA 7.5Ohm SOT23, N-Ch Mosfet - 60V 115MA 7.5O; Manufacturer Lifecycle Status: ACTIVE; RoHS: Compliant; NexarPartId: 97862277; Schedule B: 8541210080, 8541210080; Lifecycle Status: Production
R23 R24 R27 = CMP-2001-03967-2: RES Thick Film, 1kΩ, 5%, 0.125W, 200ppm/°C, 0805; Power Rating: 125mW; Voltage Rating: 150V; Radiation Hardening: No; Case Code (Imperial): 0805; Military Standard: Not; Contact Plating: Tin; Weight: 0.000194oz; Mount: Surface Mount; Termination: SMD/SMT; Packaging: Tape and Reel; Min Operating Temperature: -55°C; Width: 1.25mm; Tolerance: 5%; Height: 0.45mm; Depth: 1.25mm; Length: 2mm; Temperature Coefficient: 200ppm/°C; Case Code (Metric): 2012; Package Quantity: 5000; Max Operating Temperature: 155°C; Case/Package: 0805; Composition: Thick Film
R25 R26 R28 = CMP-2001-03967-2: as R5 on sheet Analog_Inputs_10V; Radiation Hardening: No; Case Code (Imperial): 0805; Military Standard: Not; Contact Plating: Tin; Weight: 0.000194oz; Mount: Surface Mount; Termination: SMD/SMT; Packaging: Tape and Reel; Min Operating Temperature: -55°C; Width: 1.25mm; Tolerance: 5%; Height: 0.45mm; Depth: 1.25mm; Length: 2mm; Temperature Coefficient: 200ppm/°C; Case Code (Metric): 2012; Package Quantity: 5000; Max Operating Temperature: 155°C; Case/Package: 0805; Composition: Thick Film

## Sheet Serial_Communication.SchDoc
size A4; SheetNumber: 10; SheetTotal: 13
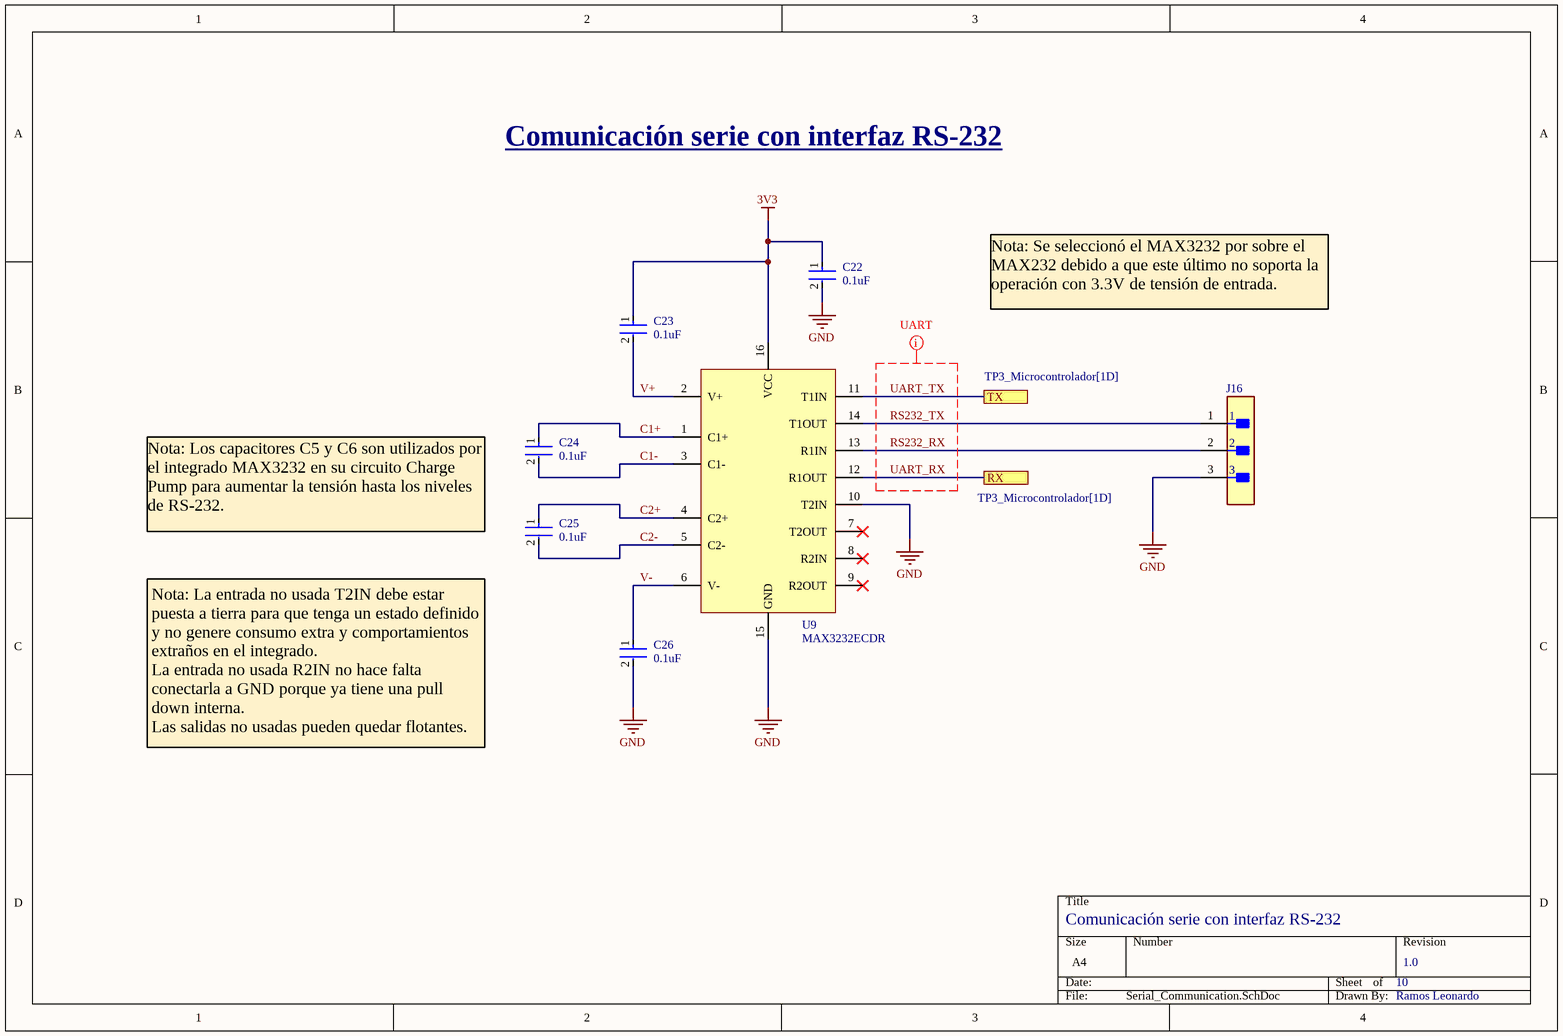
[diagram p8: Serial_Communication.SchDoc]

### Parts
C22  value 0.1uF  [FP-CC0805-0_85-MFG]  (hidden comment: CC0805KRX7R8BB104)
C23  value 0.1uF  [FP-CC0805-0_85-MFG]  (hidden comment: CC0805KRX7R8BB104)
C24  value 0.1uF  [FP-CC0805-0_85-MFG]  (hidden comment: CC0805KRX7R8BB104)
C25  value 0.1uF  [FP-CC0805-0_85-MFG]  (hidden comment: CC0805KRX7R8BB104)
C26  value 0.1uF  [FP-CC0805-0_85-MFG]  (hidden comment: CC0805KRX7R8BB104)
J16  22-11-1031  [FP-0022111031-MFG]  (value not drawn)
U9  MAX3232ECDR  [D0016A_M]

### Ports
RX (see TP3_Microcontrolador[1D]), TX (see TP3_Microcontrolador[1D])

### Nets
3V3: C22.1 C23.1 U9.16(VCC)
GND: C22.2 C26.2 J16.3 U9.10(T2IN) U9.15(GND)
C1+: C24.1 U9.1(C1+)
C1-: C24.2 U9.3(C1-)
C2+: C25.1 U9.4(C2+)
C2-: C25.2 U9.5(C2-)
RS232_RX: J16.2 U9.13(R1IN)
RS232_TX: J16.1 U9.14(T1OUT)
UART_RX: U9.12(R1OUT) ; port RX
UART_TX: U9.11(T1IN) ; port TX
V+: C23.2 U9.2(V+)
V-: C26.1 U9.6(V-)

Not connected (* = marked no-connect by the designer): U9 7(T2OUT)* 8(R2IN)* 9(R2OUT)*

### Layout directives
net class UART: RS232_RX, RS232_TX, UART_RX, UART_TX

### Notes on the sheet
- Comunicación serie con interfaz RS-232
- Nota: Se seleccionó el MAX3232 por sobre el MAX232 debido a que este último no soporta la operación con 3.3V de tensión de entrada.
- Nota: Los capacitores C5 y C6 son utilizados por el integrado MAX3232 en su circuito Charge Pump para aumentar la tensión hasta los niveles de RS-232.
- Nota: La entrada no usada T2IN debe estar puesta a tierra para que tenga un estado definido y no genere consumo extra y comportamientos extraños en el integrado.
  La entrada no usada R2IN no hace falta conectarla a GND porque ya tiene una pull down interna.
  Las salidas no usadas pueden quedar flotantes.
- 10
- 1.0
- Ramos Leonardo

### Library data of the parts
C22-C26 = CMP-1036-04410-2: as C17 on sheet Analog_Inputs_10V; ComponentLink2URL: http://www.yageo.com/documents/recent/UPY-GPHC_Y5V_6.3V-to-50V_8.pdf; Category: Cap; Mouser Description: Multilayer Ceramic Capacitors MLCC - SMD/SMT 100nF 25V X7R 10%; Manufacturer Part Number: CC0805KRX7R8BB104; Device Class L1: Passive Components; Footprint Url: http://www.yageo.com/exep/pages/download/literatures/UPY-C_GEN_24.pdf; Height: 0.95mm; Digikey Description: CAP CER 0.1UF 25V X7R 0805; Lead Free: Yes; Temperature Range High: +85°C; Temperature: -30°C to +85°C; Ipc Land Pattern Name: CAPC200125X85; Automotive: No; Octopart: https://octopart.com/cc0805krx7r8bb104-yageo-39467766; Device Class L2: Capacitors; Temperature Characteristic: X7R; Voltage Rating: 25 V; ComponentLink2Description: Datasheet; Temperature Range Low: -30°C; Device Class L3: Ceramic Capacitors; RoHS: TRUE; Package: CC0805-0.85
J16 = CMP-00257-00247512-1: 22-11-1031 Mini-Latch™ Wire-to-Board Header, Vertical, with Friction Ramp, 3 Circuits, Gold (Au) Plating; Manufacturer Lifecycle Status: ACTIVE; NexarPartId: 247512; Number of Positions: 3; Current Rating: 3A; Gender: Male; Pitch: 2.5mm; Connector Type: Male Pin; Contact Resistance: 20mΩ; Voltage Rating: 250V; Max Voltage Rating (DC): 250.25kV; Color: Natural; Fastening Type: Friction; RoHS: Compliant; Contact Mating Length: 7.493mm; Lifecycle Status: Production; Number of Rows: 1; Schedule B: 8536694040, 8536694040; Radiation Hardening: No; Number of Contacts: 3; Depth: 4.9mm; Termination: Solder; Housing Color: Natural; Max Operating Temperature: 105°C; Mount: Through Hole; Height: 12.1mm; Lead Free: Lead Free; Contact Gender: Male; Plating: Gold; Contact Material: Brass; Length: 7mm; Country of Origin: KR; Housing Material: Nylon; Number of Circuits: 3; Contact Plating: Gold; Packaging: Bulk; Orientation: Vertical; Min Operating Temperature: -40°C; REACH SVHC: Unknown

## Sheet Debug_Leds.SchDoc
size A4; SheetNumber: 11; SheetTotal: 13
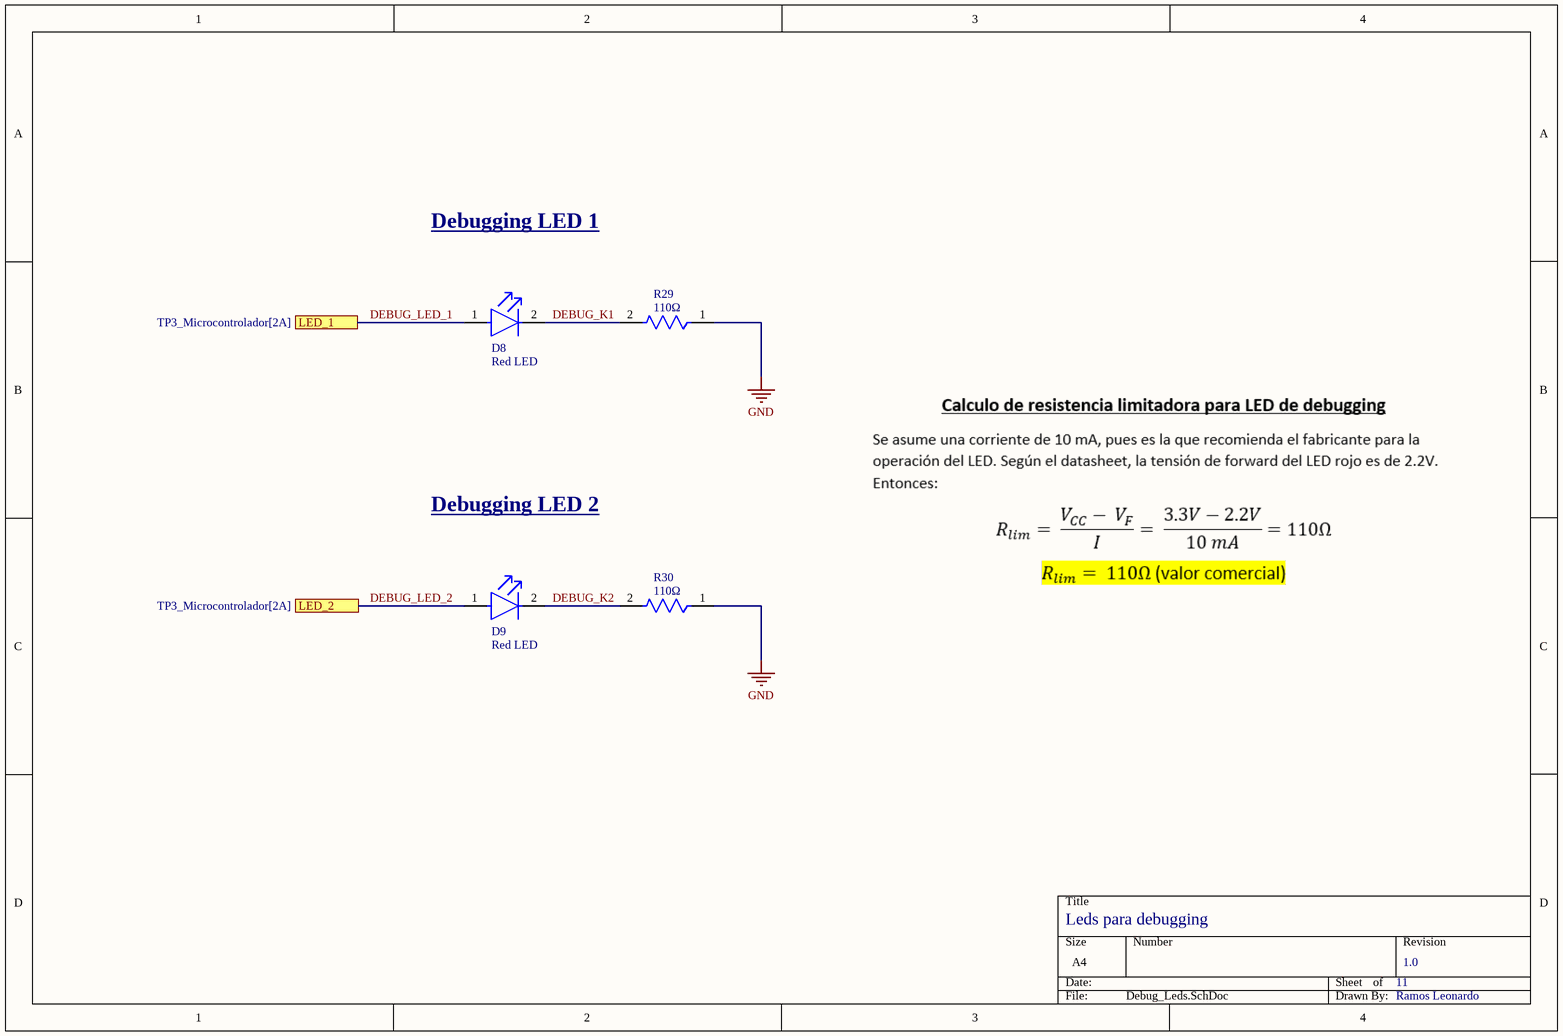
[diagram p9: Debug_Leds.SchDoc]

### Parts
D8  Red LED  [FP-SML-LX0805SRC-TR-MFG]
D9  Red LED  [FP-SML-LX0805SRC-TR-MFG]
R29  Resistance: 110Ω  [FP-CRCW0805-e3-IPC_B]  (hidden comment: CRCW08054K70JNEA)
R30  Resistance: 110Ω  [FP-CRCW0805-e3-IPC_B]  (hidden comment: CRCW08054K70JNEA)

### Ports
LED_1 (see TP3_Microcontrolador[2A]), LED_2 (see TP3_Microcontrolador[2A])

### Nets
GND: R29.1 R30.1
DEBUG_K1: D8.2(C) R29.2
DEBUG_K2: D9.2(C) R30.2
DEBUG_LED_1: D8.1(A) ; port LED_1
DEBUG_LED_2: D9.1(A) ; port LED_2

### Notes on the sheet
- Debugging LED 1
- Debugging LED 2
- Leds para debugging
- 11
- 1.0
- Ramos Leonardo

### Library data of the parts
D8 D9 = CMP-57192-000013-1: LED RED CLEAR SMD SML-LX0805SRC-TR; Forward Current: 20mA; Wavelength: 660nm; Forward Voltage: 1.7V; Luminous Intensity: 25mcd; Number of LEDs: 1; Current Rating: 25mA; Lens Color: Colorless; Power Rating: 100mW; Viewing Angle: 140°; Approvals: UL; Lens Transparency: Clear; Series: -; Package Quantity: 3000; Mount: Surface Mount; Lead Free: Lead Free; Case/Package: 0805; Max Operating Temperature: 85°C; Illumination Color: Red; Packaging: Tape and Reel; Length: 2mm; Lens Style: Clear; Width: 1.25mm; RoHS Compliant: Yes; Color: Red; Case Code (Metric): 2012; Dominant Wavelength: 660nm; Number of Pins: 2; Min Operating Temperature: -40°C; Case Code (Imperial): 0805; Voltage Rating (DC): 1.7V; Voltage Rating: 1.7V; Height: 1.2mm; Test Current: 20mA
R29 R30 = CMP-2001-03967-2: as R11 on sheet Analog_Inputs_12V; Radiation Hardening: No; Case Code (Imperial): 0805; Military Standard: Not; Contact Plating: Tin; Weight: 0.000194oz; Mount: Surface Mount; Termination: SMD/SMT; Packaging: Tape and Reel; Min Operating Temperature: -55°C; Width: 1.25mm; Tolerance: 5%; Height: 0.45mm; Depth: 1.25mm; Length: 2mm; Temperature Coefficient: 200ppm/°C; Case Code (Metric): 2012; Package Quantity: 5000; Max Operating Temperature: 155°C; Case/Package: 0805; Composition: Thick Film

## Sheet I2C_Modules.SchDoc
size A4; SheetNumber: 12; SheetTotal: 13
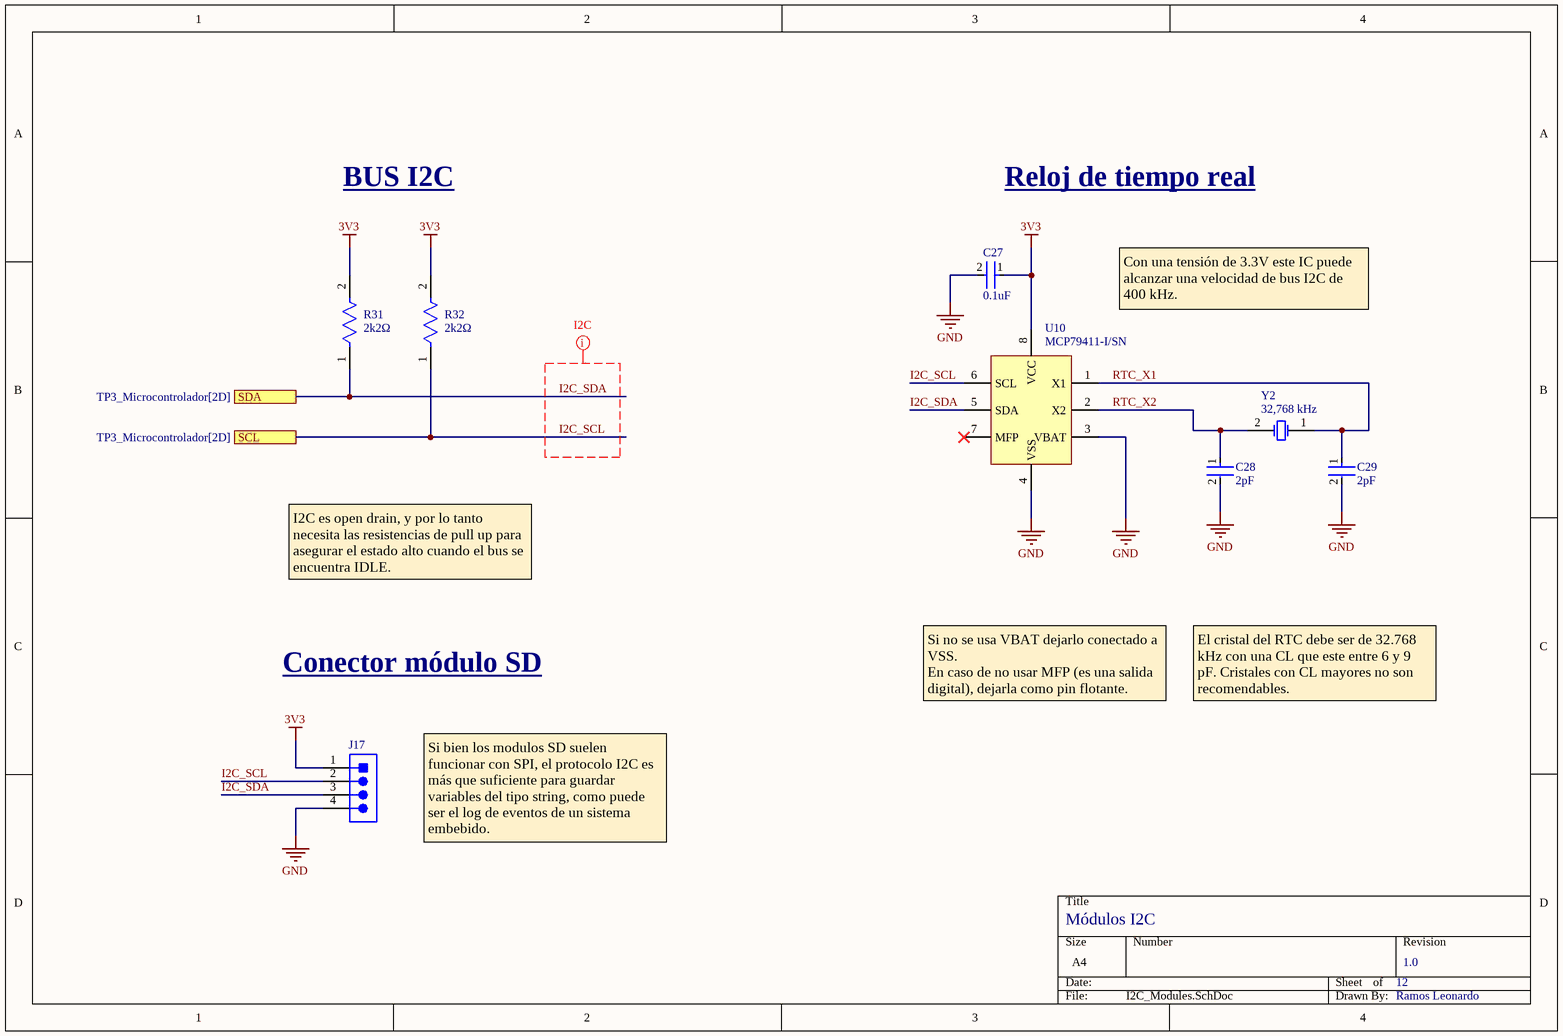
[diagram p10: I2C_Modules.SchDoc]

### Parts
C27  value 0.1uF  [FP-CC0805-0_85-MFG]  (hidden comment: CC0805KRX7R8BB104)
C28  value 2pF  [FP-CC0805-0_85-MFG]  (hidden comment: CC0805KRX7R8BB104)
C29  value 2pF  [FP-CC0805-0_85-MFG]  (hidden comment: CC0805KRX7R8BB104)
J17  22-27-2041  [MOLX-22-27-2041_V]  (value not drawn)
R31  Resistance: 2k2Ω  [FP-CRCW0805-e3-IPC_B]  (hidden comment: CRCW08054K70JNEA)
R32  Resistance: 2k2Ω  [FP-CRCW0805-e3-IPC_B]  (hidden comment: CRCW08054K70JNEA)
U10  MCP79411-I/SN  [SOIC8-RTC]
Y2  32,768 kHz  [WE-XTAL_CFPX-217]

### Ports
SCL (see TP3_Microcontrolador[2D]), SDA (see TP3_Microcontrolador[2D])

### Nets
3V3: C27.1 J17.1 R31.2 R32.2 U10.8(VCC)
GND: C27.2 C28.2 C29.2 J17.4 U10.3(VBAT) U10.4(VSS)
I2C_SCL: J17.2 R32.1 U10.6(SCL) ; port SCL
I2C_SDA: J17.3 R31.1 U10.5(SDA) ; port SDA
RTC_X1: C29.1 U10.1(X1) Y2.1(OSC1)
RTC_X2: C28.1 U10.2(X2) Y2.2(OSC2)

Not connected (* = marked no-connect by the designer): U10 7(MFP)*

### Layout directives
net class I2C: I2C_SCL, I2C_SDA

### Notes on the sheet
- BUS I2C
- Reloj de tiempo real
- Con una tensión de 3.3V este IC puede alcanzar una velocidad de bus I2C de 400 kHz.
- I2C es open drain, y por lo tanto necesita las resistencias de pull up para asegurar el estado alto cuando el bus se encuentra IDLE.
- Conector módulo SD
- Si no se usa VBAT dejarlo conectado a VSS.
  En caso de no usar MFP (es una salida digital), dejarla como pin flotante.
- El cristal del RTC debe ser de 32.768 kHz con una CL que este entre 6 y 9 pF. Cristales con CL mayores no son recomendables.
- Si bien los modulos SD suelen funcionar con SPI, el protocolo I2C es más que suficiente para guardar variables del tipo string, como puede ser el log de eventos de un sistema embebido.
- Módulos I2C
- 12
- 1.0
- Ramos Leonardo

### Library data of the parts
C27 = CMP-1036-04410-2: as C17 on sheet Analog_Inputs_10V; ComponentLink2URL: http://www.yageo.com/documents/recent/UPY-GPHC_Y5V_6.3V-to-50V_8.pdf; Category: Cap; Mouser Description: Multilayer Ceramic Capacitors MLCC - SMD/SMT 100nF 25V X7R 10%; Manufacturer Part Number: CC0805KRX7R8BB104; Device Class L1: Passive Components; Footprint Url: http://www.yageo.com/exep/pages/download/literatures/UPY-C_GEN_24.pdf; Height: 0.95mm; Digikey Description: CAP CER 0.1UF 25V X7R 0805; Lead Free: Yes; Temperature Range High: +85°C; Temperature: -30°C to +85°C; Ipc Land Pattern Name: CAPC200125X85; Automotive: No; Octopart: https://octopart.com/cc0805krx7r8bb104-yageo-39467766; Device Class L2: Capacitors; Temperature Characteristic: X7R; Voltage Rating: 25 V; ComponentLink2Description: Datasheet; Temperature Range Low: -30°C; Device Class L3: Ceramic Capacitors; RoHS: TRUE; Package: CC0805-0.85
C28 C29 = CMP-1036-04410-2: CAP CER 2pF 25V X7R 0805; Manufacturer: Yageo; Tolerance: 0.1; Material: Ceramic; ComponentLink2URL: http://www.yageo.com/documents/recent/UPY-GPHC_Y5V_6.3V-to-50V_8.pdf; Category: Cap; Mouser Description: Multilayer Ceramic Capacitors MLCC - SMD/SMT 100nF 25V X7R 10%; Manufacturer Part Number: CC0805KRX7R8BB104; Device Class L1: Passive Components; Footprint Url: http://www.yageo.com/exep/pages/download/literatures/UPY-C_GEN_24.pdf; Height: 0.95mm; Digikey Description: CAP CER 0.1UF 25V X7R 0805; Lead Free: Yes; Temperature Range High: +85°C; Temperature: -30°C to +85°C; Ipc Land Pattern Name: CAPC200125X85; Capacitance: 2pF; Automotive: No; Octopart: https://octopart.com/cc0805krx7r8bb104-yageo-39467766; Device Class L2: Capacitors; Temperature Characteristic: X7R; Voltage Rating: 25 V; ComponentLink2Description: Datasheet; Temperature Range Low: -30°C; Device Class L3: Ceramic Capacitors; RoHS: TRUE; Package: CC0805-0.85
J17 = CMP-2000-05243-1: Male Header, Pitch 2.54 mm, 1 x 4 Position, Height 11.7 mm, Tail Length 3.56 mm, RoHS, Bulk; Manufacturer: Molex; Voltage rating: 250V; Current rating: 4A; Datasheet Version: Rev. F, 06/2009; Operating temperature: 0degCto+75degC; Contact material: Tinplatedbrass; Manufacturer URL: http://www.molex.com/; Housing material: Nylon(UL94V-0); Datasheet URL: http://www.molex.com/pdm_docs/sd/022272041_sd.pdf
R31 R32 = CMP-2001-03967-2: as R11 on sheet Analog_Inputs_12V; Radiation Hardening: No; Case Code (Imperial): 0805; Military Standard: Not; Contact Plating: Tin; Weight: 0.000194oz; Mount: Surface Mount; Termination: SMD/SMT; Packaging: Tape and Reel; Min Operating Temperature: -55°C; Width: 1.25mm; Tolerance: 5%; Height: 0.45mm; Depth: 1.25mm; Length: 2mm; Temperature Coefficient: 200ppm/°C; Case Code (Metric): 2012; Package Quantity: 5000; Max Operating Temperature: 155°C; Case/Package: 0805; Composition: Thick Film
U10 = MCP79411-I/SN: Real time clock from Microchip
Y2 = CMP-03913-116876464-1: 830054236 WE-XTAL Quartz Crystal; Frequency: 32.768kHz; Min Operating Temperature: -40°C; Max Operating Temperature: 85°C; NexarPartId: 116876464; Height: 900µm; Length: 3.2mm; Width: 1.5mm